# EAGLE design SenseBox-Eye_v1.4 (EAGLE 9.6.2)
Assembly variants: komplett, ohne fuel-gauge

## Sheet 1 of 5
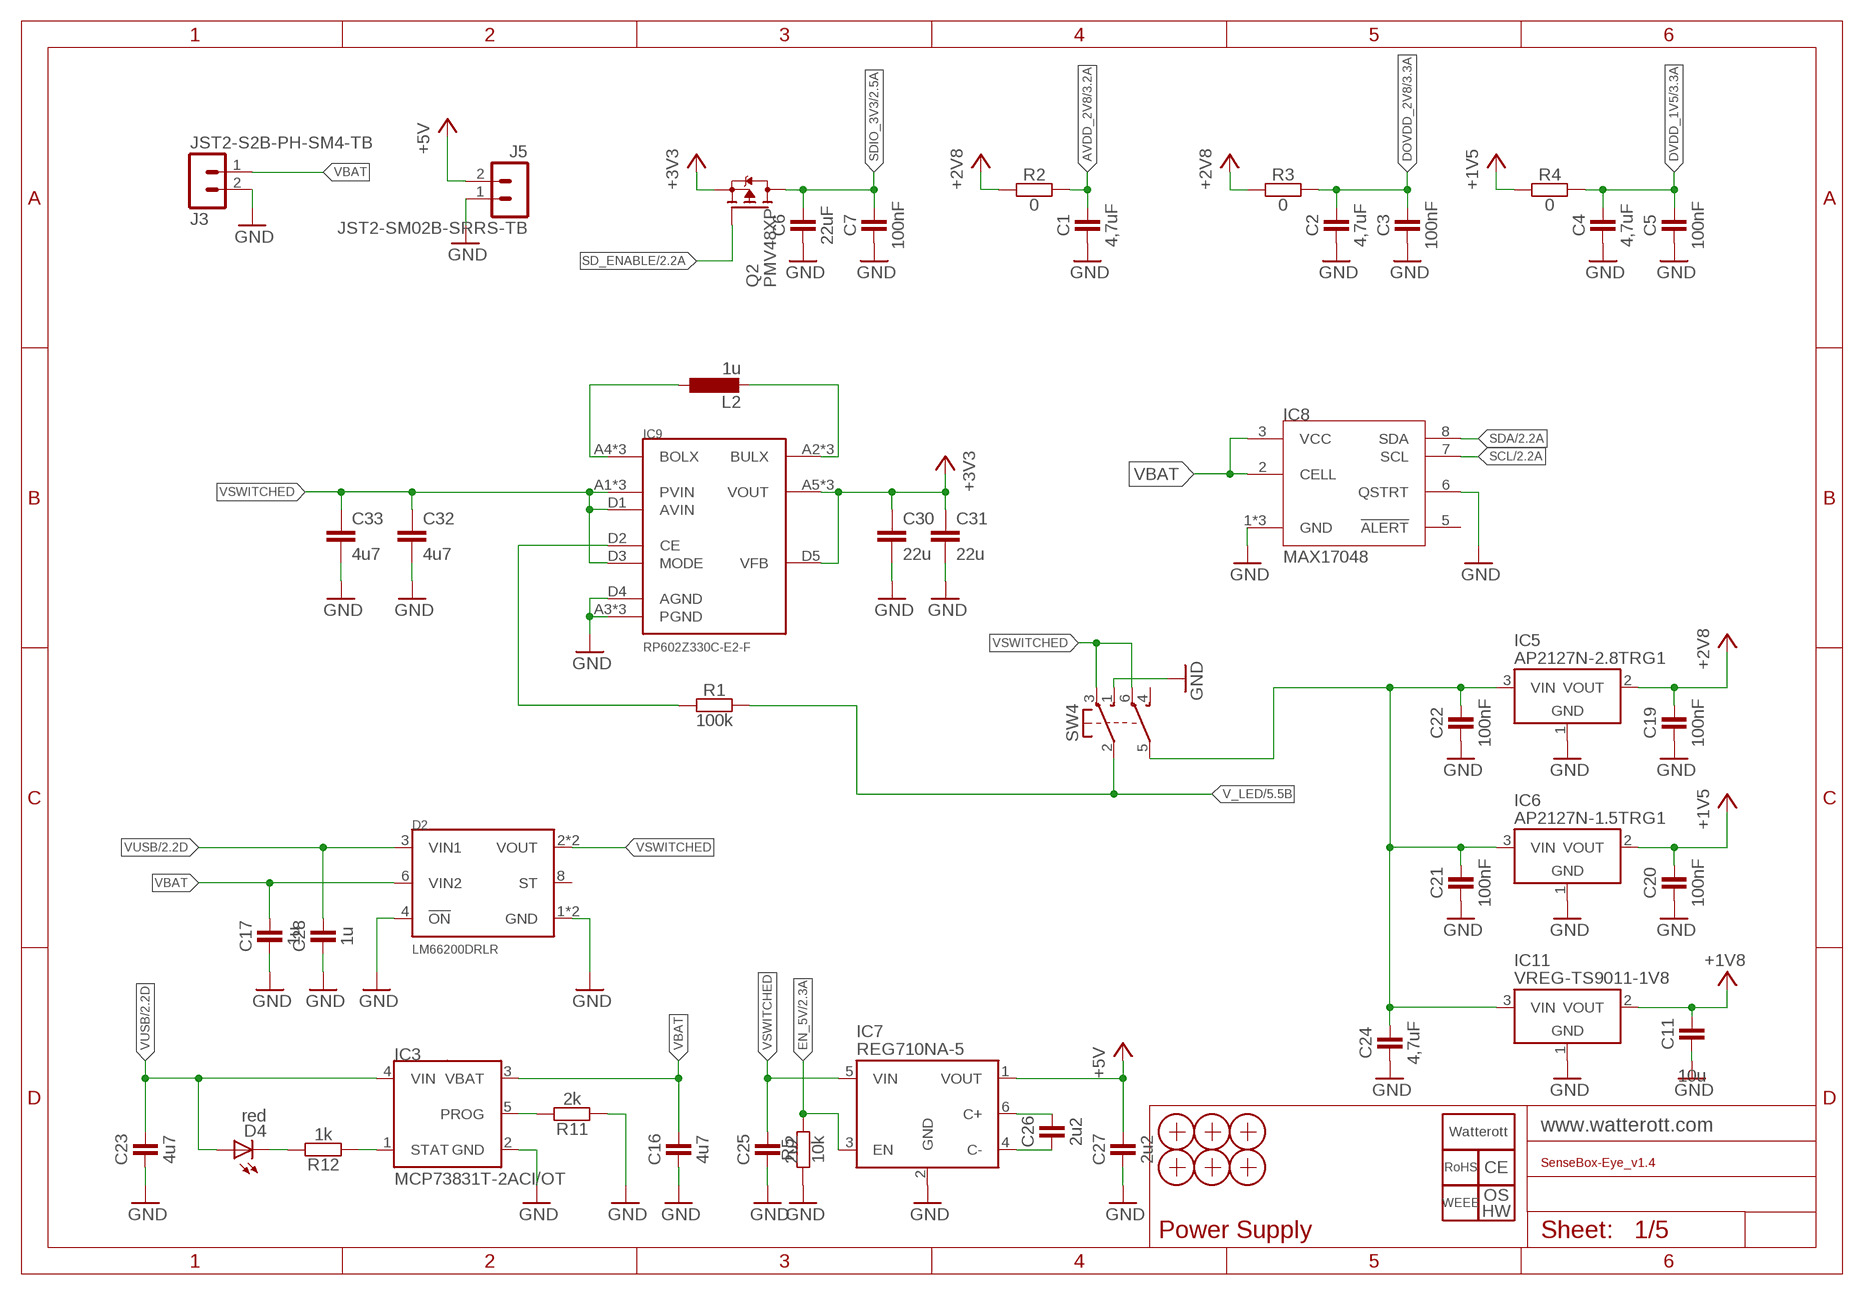
[diagram p0: schematic, sheet 1]

### Parts
C1  4,7uF  CAPACITOR-0402  [C0402]
C2  4,7uF  CAPACITOR-0402  [C0402]
C3  100nF  CAPACITOR-0402  [C0402]
C4  4,7uF  CAPACITOR-0402  [C0402]
C5  100nF  CAPACITOR-0402  [C0402]
C6  22uF  CAPACITOR-0402  [C0402]
C7  100nF  CAPACITOR-0402  [C0402]
C11  10u  CAPACITOR-0402  [C0402]
C16  4u7  CAPACITOR-0402  [C0402]
C17  1u  CAPACITOR-0402  [C0402]
C19  100nF  CAPACITOR-0402  [C0402]
C20  100nF  CAPACITOR-0402  [C0402]
C21  100nF  CAPACITOR-0402  [C0402]
C22  100nF  CAPACITOR-0402  [C0402]
C23  4u7  CAPACITOR-0402  [C0402]
C24  4,7uF  CAPACITOR-0402  [C0402]
C25  2u2  CAPACITOR-0402  [C0402]
C26  2u2  CAPACITOR-0402  [C0402]
C27  2u2  CAPACITOR-0402  [C0402]
C28  1u  CAPACITOR-0402  [C0402]
C30  22u  C_22U_0805N  [0805N]
C31  22u  C_22U_0805N  [0805N]
C32  4u7  C_4U7_0603N  [0603N]
C33  4u7  C_4U7_0603N  [0603N]
D2  LM66200DRLR  LM66200  [SOT-5X3]
D4  red  LED_RED_0603N  [0603N]
IC3  MCP73831T-2ACI/OT  MCP73831_MCP73831T-2ACI/OT_SOT23-5  [SOT23-5]
IC5  AP2127N-2.8TRG1  VREG-TS9011-3V3  [SOT23]
IC6  AP2127N-1.5TRG1  VREG-TS9011-3V3  [SOT23]
IC7  REG710NA-5  [SOT23-6]
IC8  MAX17048  MAX1704X  [UDFN8_2020]  (not fitted in variant ohne fuel-gauge)
IC9  RP602Z330C-E2-F  RP602_RP602Z330C-E2-F_WLCSP-20-P1  [WLCSP-20-P1]
IC11  VREG-TS9011-1V8  [SOT23]
J3  JST2-S2B-PH-SM4-TB  [JST_S2B-PH-SM4-TB]
J5  JST2-SM02B-SRRS-TB  [JST_SM02B-SRSS-TB]
L2  1u  L_WE-LQS-1U_5040  [5040]
LOGO2  LOGO_CE-5  [CE_5MM]
LOGO3  LOGO_OSHW-2  [OSHW_2MM]
LOGO4  LOGO_ROHS-2  [ROHS_2MM]
LOGO5  LOGO_WEEE-4  [WEEE_4MM]
LOGO6  LOGO_SPARK-2  [SPARK_2MM]
Q2  PMV48XP  MOSFET-P_PMV48XP_SOT23'  [SOT23]
R1  100k  RESISTOR-0402  [C0402]
R2  0  RESISTOR-0402  [C0402]
R3  0  RESISTOR-0402  [C0402]
R4  0  RESISTOR-0402  [C0402]
R5  10k  RESISTOR-0402  [C0402]
R11  2k  RESISTOR-0402  [C0402]
R12  1k  RESISTOR-0402  [C0402]
SW4  SW-2UM-CUS22B  [CUS22B]
X1  PASSER-04  [PASSER_04MM]
X2  PASSER-04  [PASSER_04MM]
X3  PASSER-04  [PASSER_04MM]
X4  PASSER-04  [PASSER_04MM]
X5  PASSER-04  [PASSER_04MM]
X6  PASSER-04  [PASSER_04MM]

### Nets
+1V5: C20.2 IC6.2(VOUT) R4.1
+1V8: C11.2 IC11.2(VOUT) ; also sheet 4
+2V8: C19.2 IC5.2(VOUT) R2.1 R3.1
+3V3: C30.1 C31.1 IC9.A5(VOUT) IC9.B5(VOUT) IC9.C5(VOUT) IC9.D5(VFB) Q2.2(S) ; also sheet 2,4,5
+5V: C27.2 IC7.1(VOUT) J5.2
AVDD_2V8: C1.2 R2.2 ; also sheet 3
BOLX: IC9.A4(BOLX) IC9.B4(BOLX) IC9.C4(BOLX) L2.1
BULX: IC9.A2(BULX) IC9.B2(BULX) IC9.C2(BULX) L2.2
DOVDD_2V8: C2.2 C3.2 R3.2 ; also sheet 3
DVDD_1V5: C4.2 C5.2 R4.2 ; also sheet 3
EN_5V: IC7.3(EN) R5.2 ; also sheet 2
ENABLE_3V3: IC9.D2(CE) R1.1
GND: C1.1 C2.1 C3.1 C4.1 C5.1 C6.1 C7.1 C11.1 C16.1 C17.1 C19.1 C20.1 C21.1 C22.1 C23.1 C24.1 C25.1 C27.1 C28.1 C30.2 C31.2 C32.2 C33.2 D2.1(GND) D2.4(!ON) D2.5(GND) IC3.2(GND) IC5.1(GND) IC6.1(GND) IC7.2(GND) IC8.1(GND) IC8.4(GND) IC8.6(QSTRT) IC8.TP(GND) IC9.A3(PGND) IC9.B3(PGND) IC9.C3(PGND) IC9.D4(AGND) IC11.1(GND) J3.2 J5.1 R5.1 R11.1 SW4.1(NO1) ; also sheet 2,3,4,5
N$5: C26.2 IC7.6(C+)
N$6: C26.1 IC7.4(C-)
N$8: D4.C R12.2
N$9: IC3.1(STAT) R12.1
N$10: IC3.5(PROG) R11.2
SCL: IC8.7(SCL) ; also sheet 2,4,5
SD_ENABLE: Q2.1(G) ; also sheet 2
SDA: IC8.8(SDA) ; also sheet 2,4,5
SDIO_3V3: C6.2 C7.2 Q2.3(D) ; also sheet 2
V_LED: R1.2 SW4.2(C1) ; also sheet 5
VBAT: C16.2 C17.2 D2.6(VIN2) IC3.3(VBAT) IC8.2(CELL) IC8.3(VCC) J3.1
VIN: C21.2 C22.2 C24.2 IC5.3(VIN) IC6.3(VIN) IC11.3(VIN) SW4.5(C2)
VSWITCHED: C25.2 C32.1 C33.1 D2.2(VOUT) D2.7(VOUT) IC7.5(VIN) IC9.A1(PVIN) IC9.B1(PVIN) IC9.C1(PVIN) IC9.D1(AVIN) IC9.D3(MODE) SW4.3(NC1) SW4.6(NC2)
VUSB: C23.2 C28.2 D2.3(VIN1) D4.A IC3.4(VIN) ; also sheet 2
Unconnected: D2.8(ST) IC8.5(!ALERT) SW4.4(NO2)

### Notes on the sheet
- Power Supply

## Sheet 2 of 5
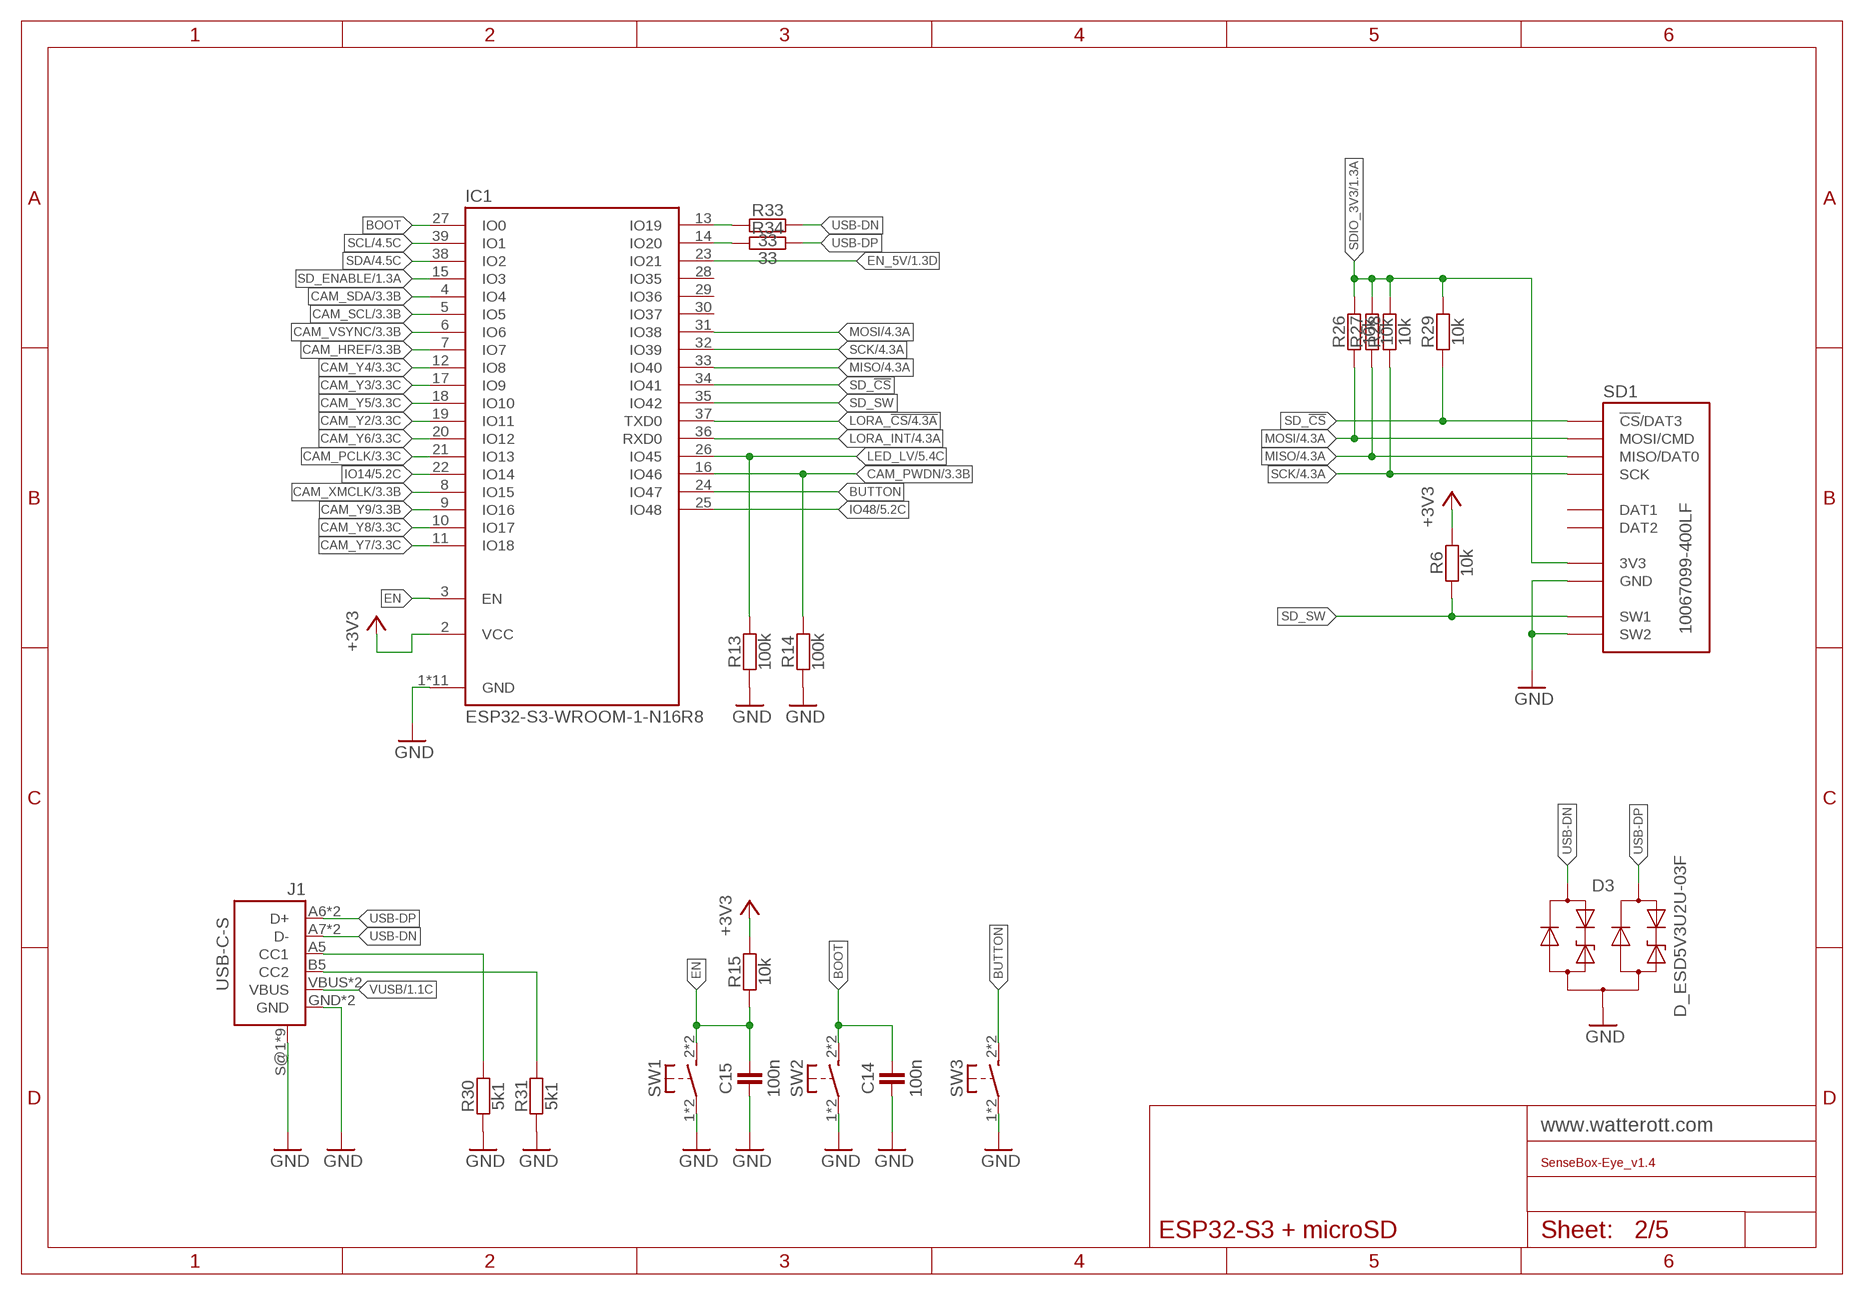
[diagram p1: schematic, sheet 2]

### Parts
C14  100n  CAPACITOR-0402  [C0402]
C15  100n  CAPACITOR-0402  [C0402]
D3  D_ESD5V3U2U-03F  [SOT723]
IC1  ESP32-S3-WROOM-1-N16R8  ESP32_S3-WROOM-1  [ESP32-S3-WROOM-1]
J1  USB-C-S  [USB-C-S]
R6  10k  RESISTOR-0402  [C0402]  (not fitted in variant ohne fuel-gauge)
R13  100k  RESISTOR-0402  [C0402]
R14  100k  RESISTOR-0402  [C0402]
R15  10k  RESISTOR-0402  [C0402]
R26  10k  RESISTOR-0402  [C0402]
R27  10k  RESISTOR-0402  [C0402]
R28  10k  RESISTOR-0402  [C0402]
R29  10k  RESISTOR-0402  [C0402]
R30  5k1  RESISTOR-0402  [C0402]
R31  5k1  RESISTOR-0402  [C0402]
R33  33  RESISTOR-0402  [C0402]
R34  33  RESISTOR-0402  [C0402]
SD1  10067099-400LF  SD-CARD-MSD47  [SD_47309XXXX]
SW1  SW-TACTILE-TL3305  [TL3305]
SW2  SW-TACTILE-TL3305  [TL3305]
SW3  SW-TACTILE-TL3305  [TL3305]

### Nets
+3V3: IC1.2(VCC) R6.2 R15.2 ; also sheet 1,4,5
BOOT: C14.2 IC1.27(IO0) SW2.2(S1) SW2.3(S1)
BUTTON: IC1.24(IO47) SW3.2(S1) SW3.3(S1)
CAM_HREF: IC1.7(IO7) ; also sheet 3
CAM_PCLK: IC1.21(IO13) ; also sheet 3
CAM_PWDN: IC1.16(IO46) R14.2 ; also sheet 3
CAM_SCL: IC1.5(IO5) ; also sheet 3
CAM_SDA: IC1.4(IO4) ; also sheet 3
CAM_VSYNC: IC1.6(IO6) ; also sheet 3
CAM_XMCLK: IC1.8(IO15) ; also sheet 3
CAM_Y2: IC1.19(IO11) ; also sheet 3
CAM_Y3: IC1.17(IO9) ; also sheet 3
CAM_Y4: IC1.12(IO8) ; also sheet 3
CAM_Y5: IC1.18(IO10) ; also sheet 3
CAM_Y6: IC1.20(IO12) ; also sheet 3
CAM_Y7: IC1.11(IO18) ; also sheet 3
CAM_Y8: IC1.10(IO17) ; also sheet 3
CAM_Y9: IC1.9(IO16) ; also sheet 3
CC1: J1.A5(CC1) R30.2
CC2: J1.B5(CC2) R31.2
EN: C15.2 IC1.3(EN) R15.1 SW1.2(S1) SW1.3(S1)
EN_5V: IC1.23(IO21) ; also sheet 1
GND: C14.1 C15.1 D3.3(A) IC1.1(GND) IC1.40(GND) IC1.P$1(GND) IC1.P$2(GND) IC1.P$3(GND) IC1.P$4(GND) IC1.P$5(GND) IC1.P$6(GND) IC1.P$7(GND) IC1.P$8(GND) IC1.P$9(GND) J1.GND J1.GND2(GND) J1.S@1(SHIELD) J1.S@2(SHIELD) J1.S@3(SHIELD) J1.S@4(SHIELD) J1.S@5(SHIELD) J1.S@6(SHIELD) J1.S@7(SHIELD) J1.S@8(SHIELD) J1.S@9(SHIELD) R13.1 R14.1 R30.1 R31.1 SD1.GND SD1.GND@1(GND) SD1.GND@2(GND) SD1.SW2 SW1.1 SW1.4(P1) SW2.1 SW2.4(P1) SW3.1 SW3.4(P1) ; also sheet 1,3,4,5
IO14: IC1.22(IO14) ; also sheet 5
IO19: IC1.13(IO19) R33.1
IO20: IC1.14(IO20) R34.1
IO48: IC1.25(IO48) ; also sheet 5
LED_LV: IC1.26(IO45) R13.2 ; also sheet 5
LORA_!CS: IC1.37(TXD0) ; also sheet 4
LORA_INT: IC1.36(RXD0) ; also sheet 4
MISO: IC1.33(IO40) R27.1 SD1.MISO(MISO/DAT0) ; also sheet 4
MOSI: IC1.31(IO38) R26.1 SD1.MOSI(MOSI/CMD) ; also sheet 4
SCK: IC1.32(IO39) R28.1 SD1.SCK ; also sheet 4
SCL: IC1.39(IO1) ; also sheet 1,4,5
SD_!CS: IC1.34(IO41) R29.1 SD1.CS(!CS!/DAT3)
SD_ENABLE: IC1.15(IO3) ; also sheet 1
SD_SW: IC1.35(IO42) R6.1 SD1.SW1
SDA: IC1.38(IO2) ; also sheet 1,4,5
SDIO_3V3: R26.2 R27.2 R28.2 R29.2 SD1.VCC(3V3) ; also sheet 1
USB-DN: D3.1(C1) J1.A7(D-) J1.B7(D-) R33.2
USB-DP: D3.2(C2) J1.A6(D+) J1.B6(D+) R34.2
VUSB: J1.VBUS J1.VBUS2(VBUS) ; also sheet 1
Unconnected: IC1.28(IO35) IC1.29(IO36) IC1.30(IO37) SD1.DAT1 SD1.DAT2

### Notes on the sheet
- ESP32-S3 + microSD

## Sheet 3 of 5
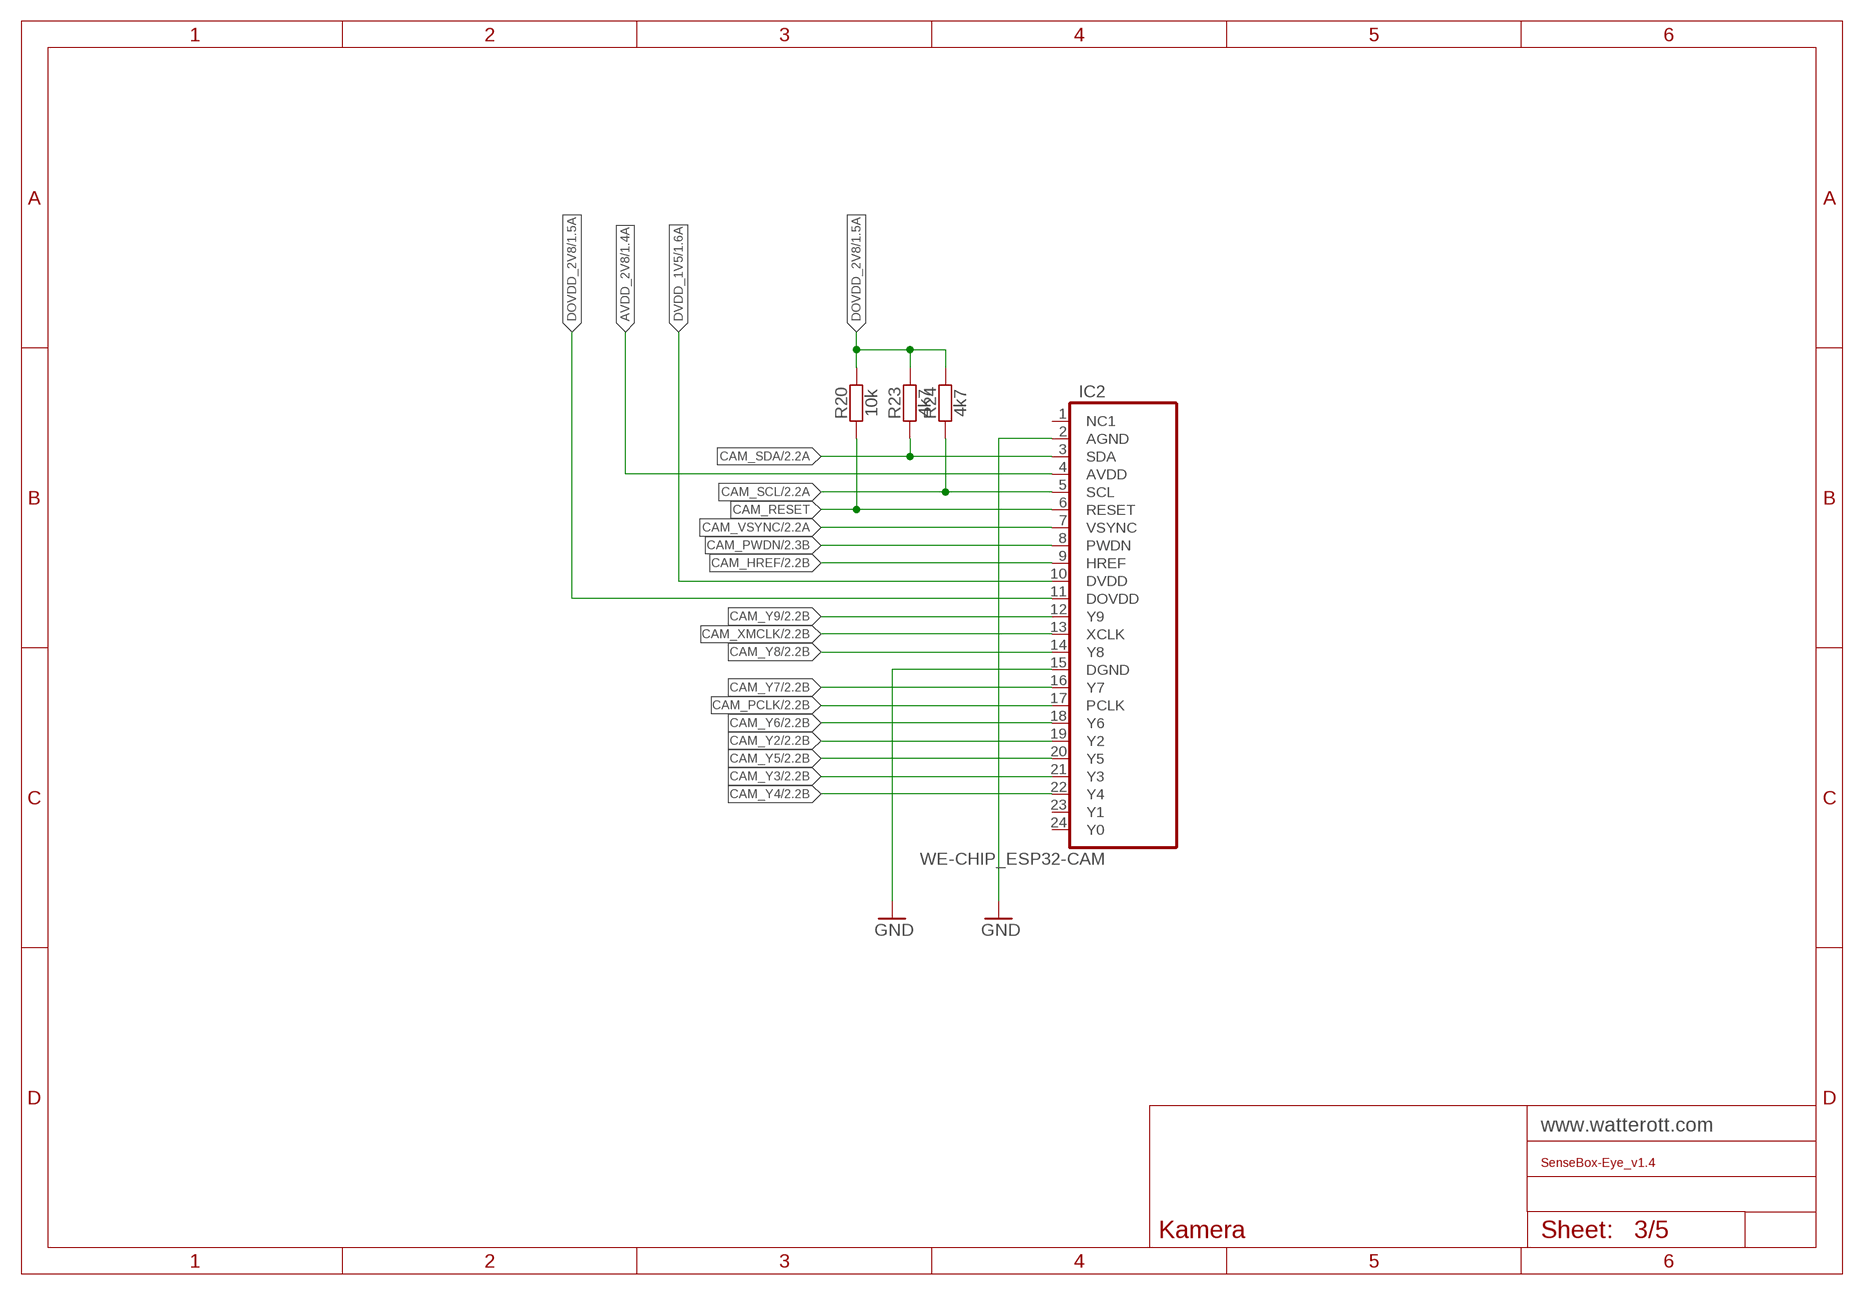
[diagram p2: schematic, sheet 3]

### Parts
IC2  WE-CHIP_ESP32-CAM  [WE-CHIP_FPC24-0.5-CAM]
R20  10k  RESISTOR-0402  [C0402]
R23  4k7  RESISTOR-0402  [C0402]
R24  4k7  RESISTOR-0402  [C0402]

### Nets
AVDD_2V8: IC2.4(AVDD) ; also sheet 1
CAM_HREF: IC2.9(HREF) ; also sheet 2
CAM_PCLK: IC2.17(PCLK) ; also sheet 2
CAM_PWDN: IC2.8(PWDN) ; also sheet 2
CAM_RESET: IC2.6(RESET) R20.1
CAM_SCL: IC2.5(SCL) R24.1 ; also sheet 2
CAM_SDA: IC2.3(SDA) R23.1 ; also sheet 2
CAM_VSYNC: IC2.7(VSYNC) ; also sheet 2
CAM_XMCLK: IC2.13(XCLK) ; also sheet 2
CAM_Y2: IC2.19(Y2) ; also sheet 2
CAM_Y3: IC2.21(Y3) ; also sheet 2
CAM_Y4: IC2.22(Y4) ; also sheet 2
CAM_Y5: IC2.20(Y5) ; also sheet 2
CAM_Y6: IC2.18(Y6) ; also sheet 2
CAM_Y7: IC2.16(Y7) ; also sheet 2
CAM_Y8: IC2.14(Y8) ; also sheet 2
CAM_Y9: IC2.12(Y9) ; also sheet 2
DOVDD_2V8: IC2.11(DOVDD) R20.2 R23.2 R24.2 ; also sheet 1
DVDD_1V5: IC2.10(DVDD) ; also sheet 1
GND: IC2.2(AGND) IC2.15(DGND) ; also sheet 1,2,4,5
Unconnected: IC2.1(NC1) IC2.23(Y1) IC2.24(Y0)

### Notes on the sheet
- Kamera

## Sheet 4 of 5
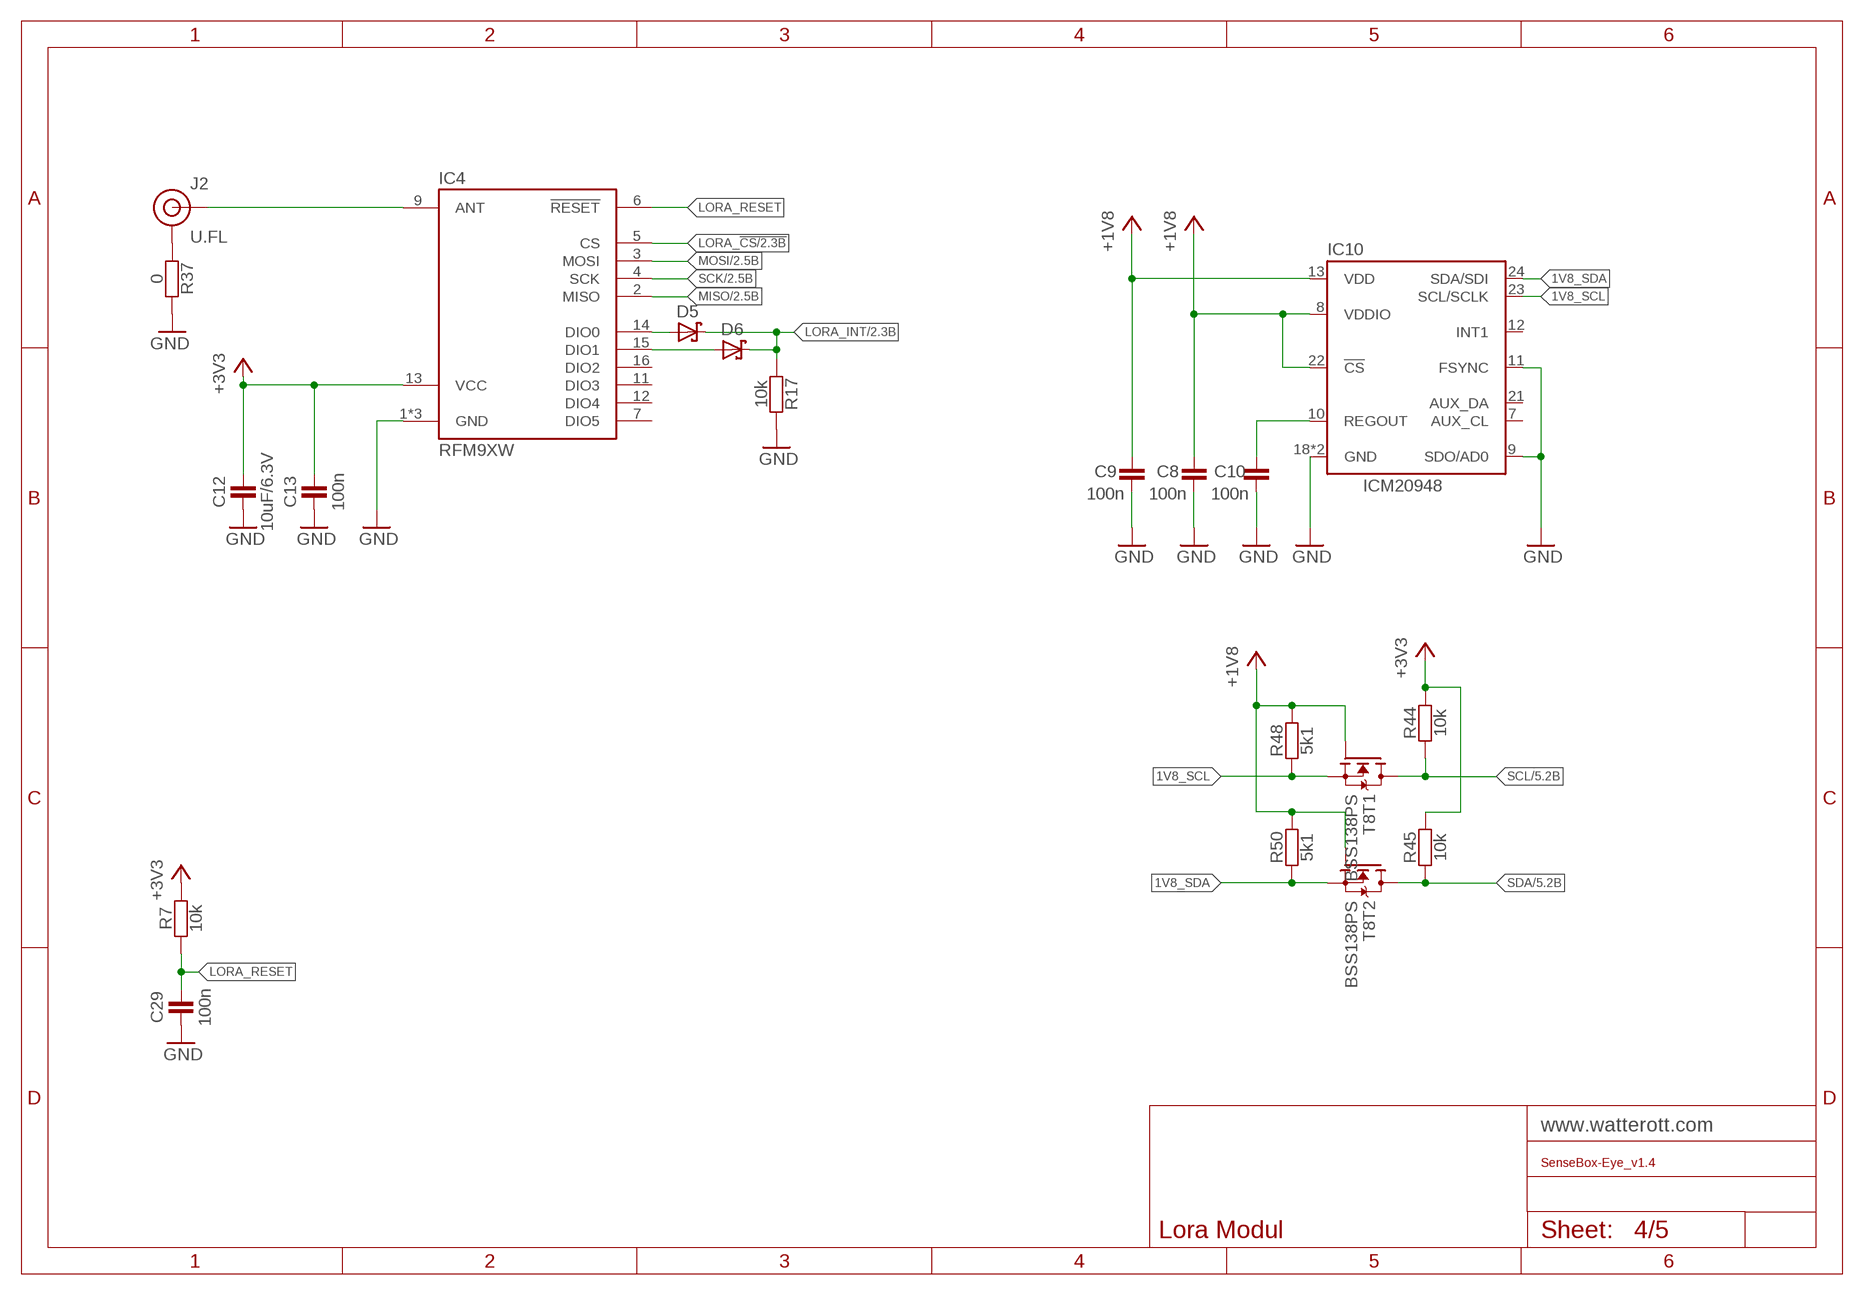
[diagram p3: schematic, sheet 4]

### Parts
C8  100n  CAPACITOR-0402  [C0402]
C9  100n  CAPACITOR-0402  [C0402]
C10  100n  CAPACITOR-0402  [C0402]
C12  10uF/6.3V  CAPACITOR-0402  [C0402]
C13  100n  CAPACITOR-0402  [C0402]
C29  100n  CAPACITOR-0402  [C0402]
D5  D_SCHOTTKY-SOD523  [SOD523]
D6  D_SCHOTTKY-SOD523  [SOD523]
IC4  RFM9XW  [RFM9X]
IC10  ICM20948  [QFN24-3X3]
J2  U.FL  [U.FL]
R7  10k  RESISTOR-0402  [C0402]
R17  10k  RESISTOR-0402  [C0402]
R37  0  RESISTOR-0402  [C0402]
R44  10k  RESISTOR-0402  [C0402]
R45  10k  RESISTOR-0402  [C0402]
R48  5k1  RESISTOR-0402  [C0402]
R50  5k1  RESISTOR-0402  [C0402]
T8  BSS138PS  [SOT363]

### Nets
1V8_SCL: IC10.23(SCL/SCLK) R48.1 T8.1(T1:S)
1V8_SDA: IC10.24(SDA/SDI) R50.1 T8.4(T2:S)
+1V8: C8.2 C9.2 IC10.8(VDDIO) IC10.13(VDD) IC10.22(!CS) R48.2 R50.2 T8.2(T1:G) T8.5(T2:G) ; also sheet 1
+3V3: C12.2 C13.2 IC4.13(VCC) R7.2 R44.2 R45.2 ; also sheet 1,2,5
ANT: IC4.9(ANT) J2.FEED(SIGNAL)
GND: C8.1 C9.1 C10.1 C12.1 C13.1 C29.1 IC4.1(GND) IC4.8(GND) IC4.10(GND) IC10.9(SDO/AD0) IC10.11(FSYNC) IC10.18(GND) IC10.20(GND) R17.1 R37.1 ; also sheet 1,2,3,5
LORA_!CS: IC4.5(CS) ; also sheet 2
LORA_INT: D5.C D6.C R17.2 ; also sheet 2
LORA_RESET: C29.2 IC4.6(!RESET) R7.1
MISO: IC4.2(MISO) ; also sheet 2
MOSI: IC4.3(MOSI) ; also sheet 2
N$1: D5.A IC4.14(DIO0)
N$2: D6.A IC4.15(DIO1)
N$3: J2.1(GND) J2.2(GND) R37.2
REGOUT1: C10.2 IC10.10(REGOUT)
SCK: IC4.4(SCK) ; also sheet 2
SCL: R44.1 T8.6(T1:D) ; also sheet 1,2,5
SDA: R45.1 T8.3(T2:D) ; also sheet 1,2,5
Unconnected: IC4.7(DIO5) IC4.11(DIO3) IC4.12(DIO4) IC4.16(DIO2) IC10.7(AUX_CL) IC10.12(INT1) IC10.21(AUX_DA)

### Notes on the sheet
- Lora Modul

## Sheet 5 of 5
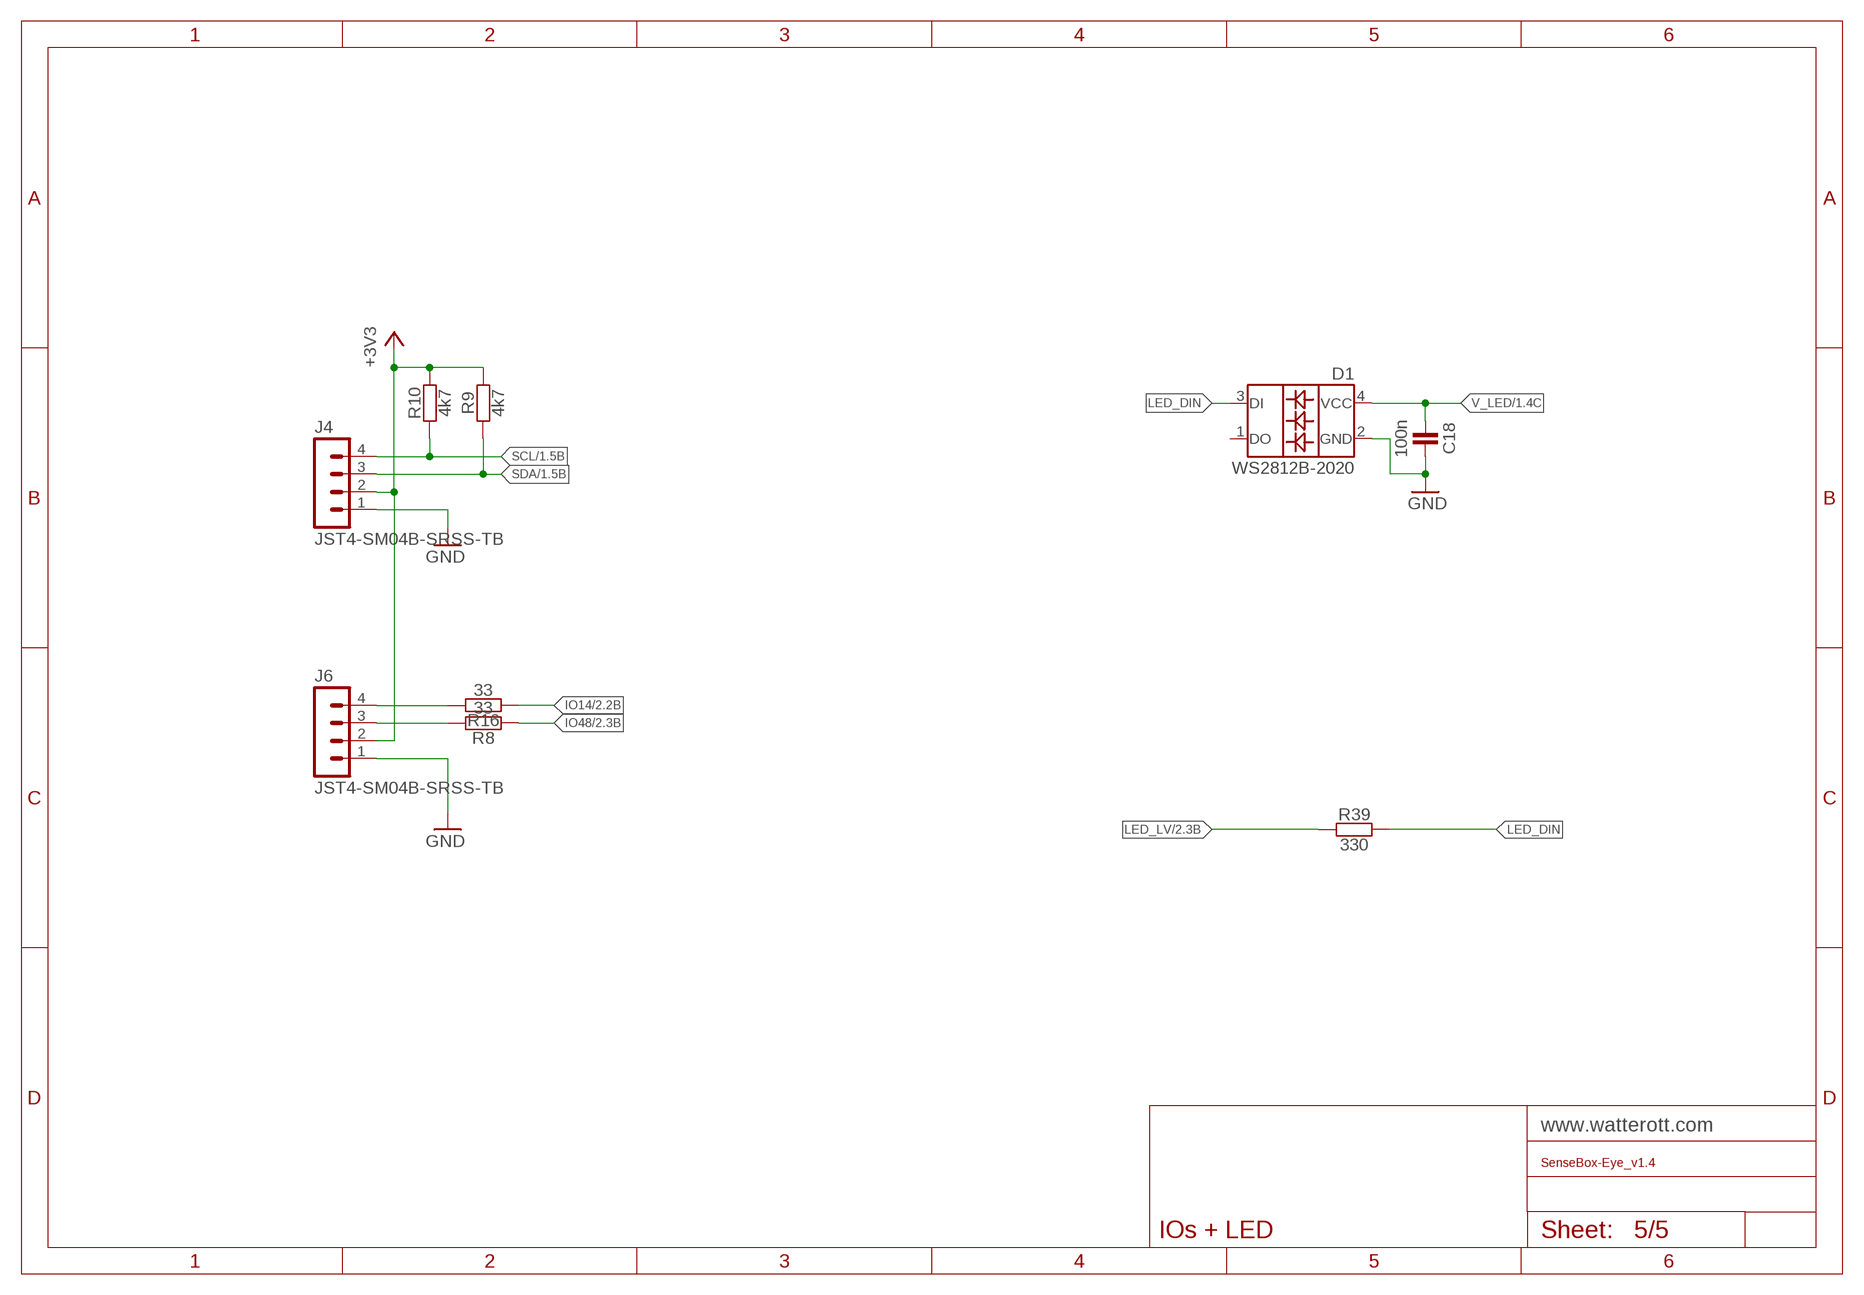
[diagram p4: schematic, sheet 5]

### Parts
C18  100n  CAPACITOR-0402  [C0402]
D1  WS2812B-2020  [WS2812_2020]
J4  JST4-SM04B-SRSS-TB  [JST_SM04B-SRSS-TB]
J6  JST4-SM04B-SRSS-TB  [JST_SM04B-SRSS-TB]
R8  33  RESISTOR-0402  [C0402]
R9  4k7  RESISTOR-0402  [C0402]
R10  4k7  RESISTOR-0402  [C0402]
R16  33  RESISTOR-0402  [C0402]
R39  330  RESISTOR-0402  [C0402]

### Nets
+3V3: J4.2 J6.2 R9.1 R10.1 ; also sheet 1,2,4
GND: C18.1 D1.2(GND) J4.1 J6.1 ; also sheet 1,2,3,4
IO14: R16.2 ; also sheet 2
IO48: R8.2 ; also sheet 2
LED_DIN: D1.3(DI) R39.2
LED_LV: R39.1 ; also sheet 2
N$4: J6.4 R16.1
N$13: J6.3 R8.1
SCL: J4.4 R10.2 ; also sheet 1,2,4
SDA: J4.3 R9.2 ; also sheet 1,2,4
V_LED: C18.2 D1.4(VCC) ; also sheet 1
Unconnected: D1.1(DO)

### Notes on the sheet
- IOs + LED

## Library data of the parts
C1-C29 = we-rcl:CAPACITOR: Capacitor ...2.2uF @ 6.3V -> 0402 ...4.7uF @ 6.3V -> 0603 ...10uF @ 16V -> 0805 ...22uF @ 25V -> 1206
C30 C31 = BE_capacitor:C: Capacitor; BE#: 208; DIELECTRIC: X5R; VOLTAGE: 6V3
C32 C33 = BE_capacitor:C: Capacitor; BE#: 284; DIELECTRIC: X5R; VOLTAGE: 6V3
D1 = we-opto:WS2812B: WS2812 RGB LED (built-in driver)
D2 = BE_diode:LM66200: LM66200 1.6-5V, 2.5A Dual Ideal Diode with Automatic Switchover; BE#: 2291
D3 = we-rcl:D_ESD5V3U2U: ESD5V3U2U TVS Diode (Uni-directional Ultra Low ESD) Vrwm=5.3V, 0.4pF@1MHz; DIGIKEY: ESD5V3U2U-03F H6327DKR-ND
D4 = BE_opto:LED: Single LED; BE#: 224
D5 D6 = we-rcl:D_SCHOTTKY: Schottky Diode 1A, 30V - SOD323 (BAS3010B) 3A, 100V - SOD123 (S310A)
IC1 = we-chip:ESP32_S3-WROOM-1: Espressif ESP32-S3-WROOM-1 ESP32 WiFi/WLAN + Bluetooth/BLE Module<
IC2 = SenseBox-Eye:WE-CHIP_ESP32-CAM: ESP32-CAM OV2640 Camera module
IC3 = BE_dcdc:MCP73831: Miniature Single-Cell, Fully Integrated Li-Ion, Li-Polymer Charge Management Controllers up to 500mA; BE#: 2283
IC4 = we-chip:RFM9X: HopeRF RFM9xW LoRa Module RFM95W 868/915 MHz (SX1276 compatible) RFM96W 433/470 MHz (SX1276 compatible)
IC5 IC6 IC11 = we-power:VREG: Voltage Regulator LDOs Taiwan Semi TS1117 800mA max 15V - compatible On Semi NCP1117 1A max 20V - compatible Diodes AP2111H 0.6A max 6V (0.25V@0.6A) - compatible Diodes AP2114H 1A max 6V (0.45V@1A) Taiwan Semi TS9011 250mA max 12V - compatible Diodes AP2210 300mA max 15V - compatible Microchip MCP1700 250mA max 6.5V - compatible Microchip MCP1702 250mA max 13V - compatible Microchip MCP1703 250mA max 16V - compatible Microchip MCP1754 150mA max 16V Taiwan Semi TS5204 80mA max 16V (low noise) DC/DC Converter Modules Recom R-78Ex.x-1.0-W36 1A max 28V - compatible CUI V78xx-2000 2A max 18V Murata OKI-78SR-x.x/1.5-W36 1.5A max 36V
IC7 = we-power:REG710NA: TI REG710xx Charge Pump with Regulated Output TI REG710xx (60mA) 5.5V - REG71055 5.0V - REG710NA-5 or REG71050 3.3V - REG710NA-3.3 3.0V - REG710NA-3 2.7V - REG710NA-2.7 2.5V - REG710NA-2.5 Diodes AP3602 (100mA) 5.0V - AP3602A 4.5V - AP3602B OnSemi CAT3200 (100mA) 5.0V - CAT3200TDI
IC8 = we-power:MAX1704X
IC9 = BE_dcdc:RP602: 1.5 A PWM/VFM Buck-Boost DC/DC Converter with Synchronous Rectifier; BE#: 2281
IC10 = we-sensor:ICM20948
J1 = we-con:USB-C: USB-C Connector Hroparts TYPE-C-31-M-12 or Jing C167321 or XKB U262-161N-4BVC11 Up: XKB U263-241N-4BQC11-1 or Wuerth 632722110112
J2 = we-con:U.FL: U.FL Connector
J3 J5 = we-con:JST2: JST Connector
J4 J6 = we-con:JST4: JST Connector
L2 = BE_inductor:L: Inductor; BE#: 2282; CURRENT: 4.9; INDUCTANCE: 1u
LOGO2 = we-symbol:LOGO_CE: CE Logo
LOGO3 = we-symbol:LOGO_OSHW: Open-Source-Hardware Logo
LOGO4 = we-symbol:LOGO_ROHS: RoHS Logo
LOGO5 = we-symbol:LOGO_WEEE: WEEE Logo
LOGO6 = we-symbol:LOGO_SPARK: Watterott electronic Logo
Q2 = BE_transistor:MOSFET-P: Single P-Channel Mosfet; BE#: 271; CURRENT: 3.5; VOLTAGE: 20
R1-R17 R20 R23 R24 R26-R31 R33 R34 R37 R39 R44 R45 R48 R50 = we-rcl:RESISTOR: Resistor all kinds in 0402 and 0603
SD1 = we-con:SD-CARD: SD-Card Socket
SW1-SW3 = we-switch:SW-TACTILE: Tactile Switche
SW4 = we-switch:SW-2UM: Switch; DIGIKEY: 563-1105-6-ND
T8 = we-transistor:BSS138PS: BSS138 Dual N-Chn MOSFET (Vgs>=+/-20V, Vds>=40V, Id>=0.2A + Rds<=3Ohm @ Vgs=4.5V) BSS138PS compatible: 2N7002PS, Si1926DL, BSS138BKS (with ESD protection)
X1-X6 = we-symbol:PASSER: Fiducial Marker

## Board
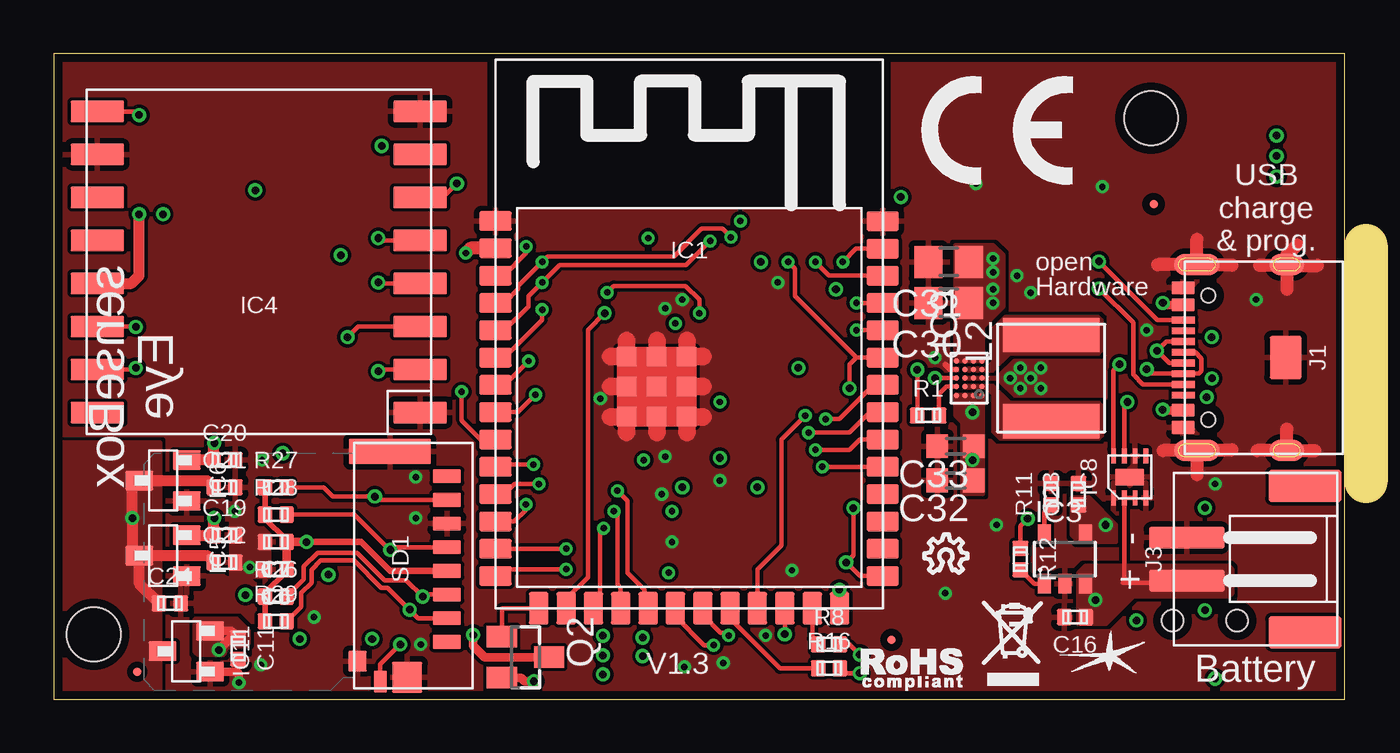
[diagram p5: board, top side]
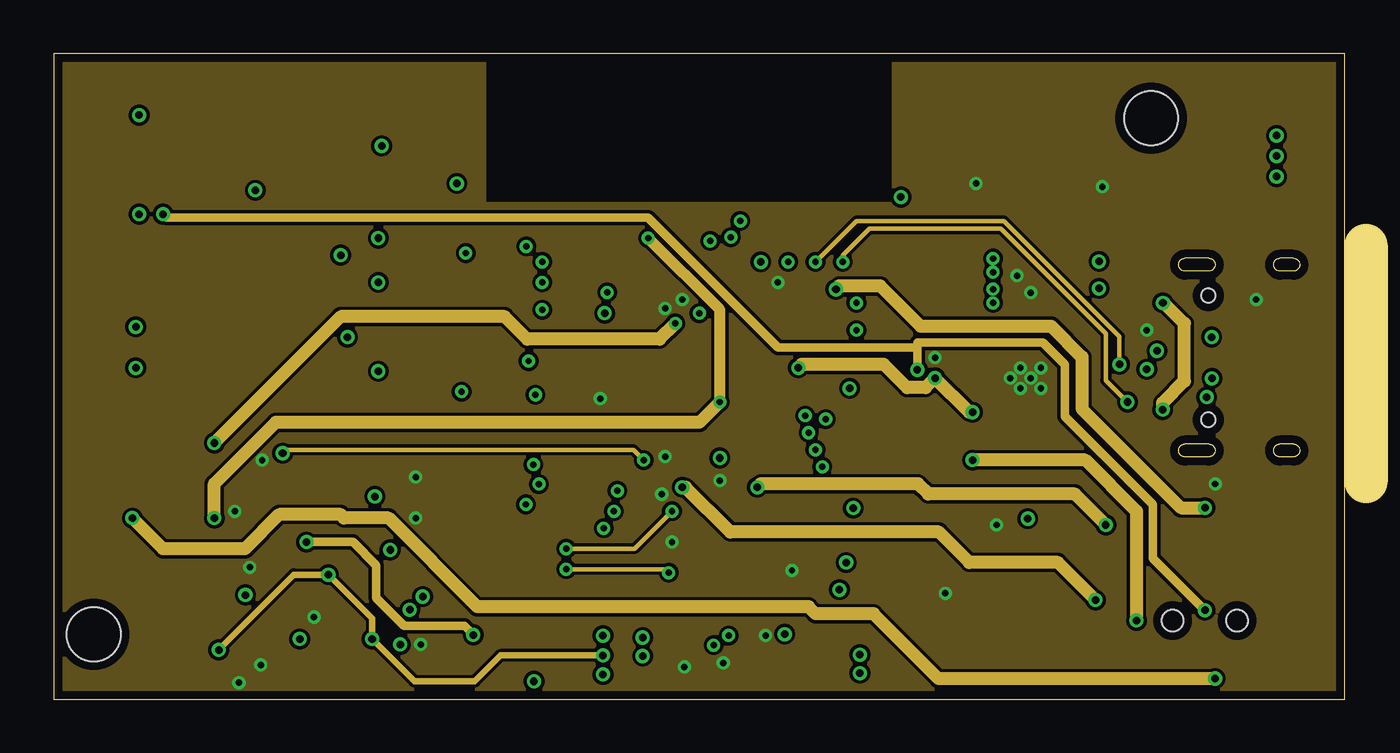
[diagram p6: board, inner layer Route2]
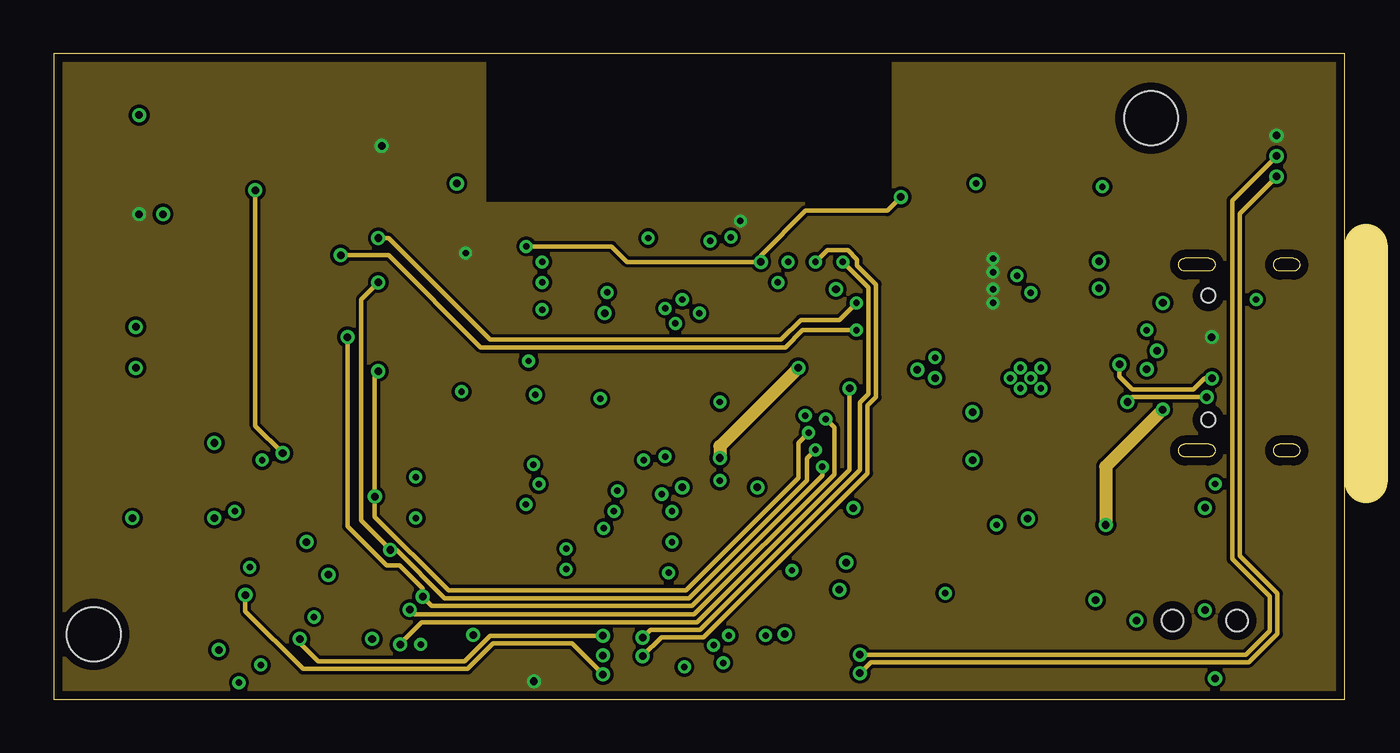
[diagram p7: board, inner layer Route15]
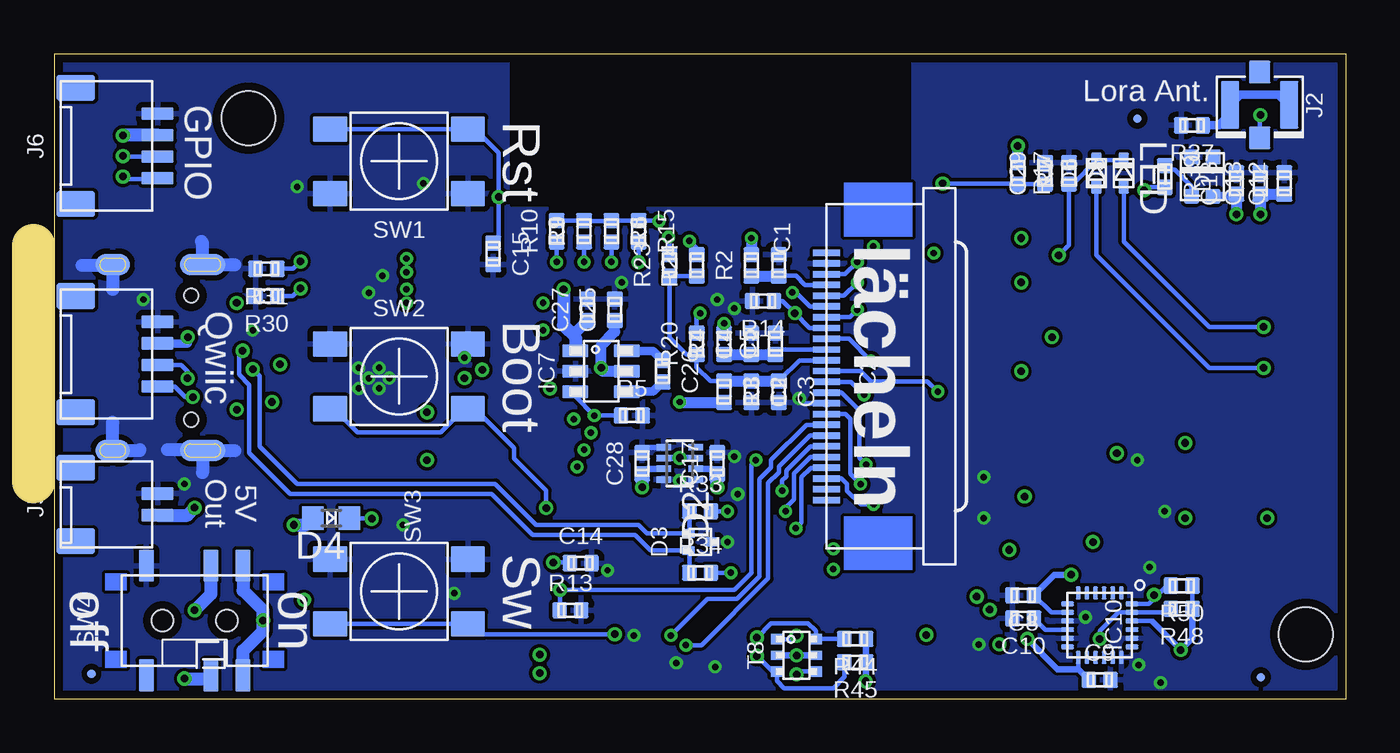
[diagram p8: board, bottom side, seen from below]

Size 60 x 30 mm. Coordinates in mm from the lower left corner, seen from the top.
Outline: 0,0 60,0 60,30 0,30 0,0
Copper layers (1+2*15+16): Top 0.035mm / dielectric 0.35mm / Route2 0.035mm / dielectric 0.76mm / Route15 0.035mm / dielectric 0.35mm / Bottom 0.035mm
Design rules "we-dru-4-layer": minimum track width 6mil, minimum drill 0.3mm, track to track 6mil, track to pad 6mil, pad to pad 8mil, via to via 8mil, smd to smd 4mil, copper to edge 0.4mm, drill to drill 0.4mm, minimum pad ring 6mil, minimum via ring 6mil, stop-mask expansion 0.1mm, vias tented up to drill 0.5mm, thermal gap 0.25mm
Holes 2.5 mm at 1.86,3 51,27
Milling: 1 lines

### Footprints (pad centres in the part's own frame; a part is rotated, then mirrored left to right if it is on the bottom)
C0402 = smd 0.75 x 0.7: 1 0,0.5; 2 0,-0.5
0805N = smd 1.3 x 1.5: 1 -0.95,0; 2 0.95,0
0603N = smd 1 x 1.1: 1 -0.85,0; 2 0.85,0
WS2812_2020 = smd 0.7 x 0.7: 1 -0.915,0.5; 2 -0.915,-0.5; 3 0.915,-0.5; 4 0.915,0.5
SOT-5X3 = smd 0.3 x 0.67: 1 -0.75,-0.74; 2 -0.25,-0.74; 3 0.25,-0.74; 4 0.75,-0.74; 5 0.75,0.74; 6 0.25,0.74; 7 -0.25,0.74; 8 -0.75,0.74
SOT723 = smd 0.6 x 0.4: 1 -0.55,0.4; 2 -0.55,-0.4; 3 0.55,0
0603N' = smd 1 x 1.1: A 0.85,0; C -0.85,0
SOD523 = smd 0.5 x 0.7: A 0,-0.6; C 0,0.6
ESP32-S3-WROOM-1 = smd 1.5 x 0.9: 1 -9,8.255; 2 -9,6.985; 3 -9,5.715; 4 -9,4.445; 5 -9,3.175; 6 -9,1.905; 7 -9,0.635; 8 -9,-0.635; 9 -9,-1.905; 10 -9,-3.175; 11 -9,-4.445; 12 -9,-5.715; 13 -9,-6.985; 14 -9,-8.255; 27 9,-8.255; 28 9,-6.985; 29 9,-5.715; 30 9,-4.445; 31 9,-3.175; 32 9,-1.905; 33 9,-0.635; 34 9,0.635; 35 9,1.905; 36 9,3.175; 37 9,4.445; 38 9,5.715; 39 9,6.97; 40 9,8.24 | smd 0.9 x 1.5: 15 -6.985,-9.745; 16 -5.715,-9.745; 17 -4.445,-9.745; 18 -3.175,-9.745; 19 -1.905,-9.745; 20 -0.635,-9.745; 21 0.635,-9.745; 22 1.905,-9.745; 23 3.175,-9.745; 24 4.445,-9.745; 25 5.73,-9.745; 26 7,-9.745 | smd 0.9 x 0.9: P$1 -1.5,0.555; P$2 -0.1,0.555; P$3 -0.1,-0.845; P$4 -1.5,-0.845; P$5 -2.9,-0.845; P$6 -2.9,0.555; P$7 -2.9,1.955; P$8 -1.5,1.955; P$9 -0.1,1.955
WE-CHIP_FPC24-0.5-CAM = smd 1.27 x 0.279: 1 0,5.75; 2 0,5.25; 3 0,4.75; 4 0,4.25; 5 0,3.75; 6 0,3.25; 7 0,2.75; 8 0,2.25; 9 0,1.75; 10 0,1.25; 11 0,0.75; 12 0,0.25; 13 0,-0.25; 14 0,-0.75; 15 0,-1.25; 16 0,-1.75; 17 0,-2.25; 18 0,-2.75; 19 0,-3.25; 20 0,-3.75; 21 0,-4.25; 22 0,-4.75; 23 0,-5.25; 24 0,-5.75
SOT23-5 = smd 0.6 x 0.9: 1 -0.95,-1.15; 2 0,-1.15; 3 0.95,-1.15; 4 0.95,1.15; 5 -0.95,1.15
RFM9X = smd 2.5 x 1: 1 -7.5,7; 2 -7.5,5; 3 -7.5,3; 4 -7.5,1; 5 -7.5,-1; 6 -7.5,-3; 7 -7.5,-5; 8 -7.5,-7; 9 7.5,-7; 10 7.5,-5; 11 7.5,-3; 12 7.5,-1; 13 7.5,1; 14 7.5,3; 15 7.5,5; 16 7.5,7
SOT23 = smd 1.3 x 0.9: 1 -1.1,0.95; 2 -1.1,-0.95; 3 1.1,0
SOT23-6 = smd 1.2 x 0.6: 1 -1.2,0.95; 2 -1.2,0; 3 -1.2,-0.95; 4 1.2,-0.95; 5 1.2,0; 6 1.2,0.95
UDFN8_2020 = smd 0.7 x 0.28: 1 -0.975,0.75; 2 -0.975,0.25; 3 -0.975,-0.25; 4 -0.975,-0.75; 5 0.975,-0.75; 6 0.975,-0.25; 7 0.975,0.25; 8 0.975,0.75 | smd 0.8 x 1.35: TP 0,0
WLCSP-20-P1 = smd 0.265 x 0.265: A1 -0.8,-0.6; A2 -0.4,-0.6; A3 0,-0.6; A4 0.4,-0.6; A5 0.8,-0.6; B1 -0.8,-0.2; B2 -0.4,-0.2; B3 0,-0.2; B4 0.4,-0.2; B5 0.8,-0.2; C1 -0.8,0.2; C2 -0.4,0.2; C3 0,0.2; C4 0.4,0.2; C5 0.8,0.2; D1 -0.8,0.6; D2 -0.4,0.6; D3 0,0.6; D4 0.4,0.6; D5 0.8,0.6
QFN24-3X3 = smd 0.6 x 0.22: 1 -1.5,1; 2 -1.5,0.6; 3 -1.5,0.2; 4 -1.5,-0.2; 5 -1.5,-0.6; 6 -1.5,-1; 13 1.5,-1; 14 1.5,-0.6; 15 1.5,-0.2; 16 1.5,0.2; 17 1.5,0.6; 18 1.5,1 | smd 0.22 x 0.6: 7 -1,-1.5; 8 -0.6,-1.5; 9 -0.2,-1.5; 10 0.2,-1.5; 11 0.6,-1.5; 12 1,-1.5; 19 1,1.5; 20 0.6,1.5; 21 0.2,1.5; 22 -0.2,1.5; 23 -0.6,1.5; 24 -1,1.5
USB-C-S = smd 1.1 x 0.3: A5 -1.155,-1.25; A6 -1.155,-0.25; A7 -1.155,0.25; A8 -1.155,1.25; B5 -1.155,1.75; B6 -1.155,0.75; B7 -1.155,-0.75; B8 -1.155,-1.75 | smd 1.05 x 0.6: GND -1.175,3.25; GND2 -1.175,-3.25; VBUS -1.175,2.45; VBUS2 -1.175,-2.45 | smd 2.1 x 1: S@1 -0.53,4.32; S@5 -0.53,-4.32 | smd 2.1 x 1 bottom: S@2 -0.53,4.32; S@6 -0.53,-4.32 | smd 1.6 x 1: S@3 3.65,4.32; S@7 3.65,-4.32 | smd 1.6 x 1 bottom: S@4 3.65,4.32; S@8 3.65,-4.32 | smd 1.5 x 2: S@9 3.6,0 | hole 0.65: 0,-2.89; 0,2.89
U.FL = smd 2.2 x 0.85: 1 0,1.375; 2 0,-1.375 | smd 1.05 x 1: FEED 1.525,0; NC -1.525,0
JST_S2B-PH-SM4-TB = smd 3.5 x 1: 1 1,1; 2 1,-1 | smd 3.4 x 1.5: SHLD1 -4.5,3.4; SHLD2 -4.5,-3.4
JST_SM04B-SRSS-TB = smd 1.5 x 0.6: 1 2.4,1.5; 2 2.4,0.5; 3 2.4,-0.5; 4 2.4,-1.5 | smd 1.8 x 1.2: SHLD1 -1.4,-2.7; SHLD2 -1.4,2.7
JST_SM02B-SRSS-TB = smd 1.5 x 0.6: 1 2.4,0.5; 2 2.4,-0.5 | smd 1.8 x 1.2: SHLD1 -1.4,-1.7; SHLD2 -1.4,1.7
5040 = smd 1.6 x 4.5: 1 -2,0; 2 2,0
SOT23' = smd 1 x 1.4: 1 -0.95,-1.1; 2 0.95,-1.1; 3 0,1.1
SD_47309XXXX = smd 0.65 x 1.3: CS 2.75,4.3; DAT1 -3.85,4.3; DAT2 3.85,4.3; GND -1.65,4.3; MISO -2.75,4.3; MOSI 1.65,4.3; SCK -0.55,4.3; VCC 0.55,4.3 | smd 1.2 x 3.8: GND@1 -5,1.65 | smd 1.45 x 1.4: GND@2 5.5,2.45 | smd 1 x 0.6: SW1 5.7,1.2 | smd 0.95 x 0.85: SW2 4.75,0.15
TL3305 = smd 1.6 x 1.2: 1 -3.2,1.5; 2 -3.2,-1.5; 3 3.2,-1.5; 4 3.2,1.5
CUS22B = smd 0.7 x 1.5: 1 -2.25,2.55; 2 0.75,2.55; 3 2.25,2.55; 4 -2.25,-2.55; 5 0.75,-2.55; 6 2.25,-2.55 | hole 1: -1.5,0; 1.5,0
SOT363 = smd 0.6 x 0.5: 1 -0.9,0.75; 3 -0.9,-0.75; 4 0.9,-0.75; 6 0.9,0.75 | smd 0.6 x 0.4: 2 -0.9,0; 5 0.9,0
PASSER_04MM = smd 0.4 x 0.4: X 0,0

### Placement (x,y rotation side)
C1  26.35,20.16 0 bottom
C2  27.62,14.29 180 bottom
C3  26.35,14.29 180 bottom
C4  27.62,16.51 0 bottom
C5  26.51,16.51 0 bottom
C6  10.32,6.03 90 top
C7  10.32,7.3 90 top
C8  14.99,4.83 90 bottom
C9  11.43,0.89 270 bottom
C10  14.99,3.75 90 bottom
C11  8.57,2.35 180 top
C12  2.86,23.97 0 bottom
C13  3.97,23.97 0 bottom
C14  35.56,6.32 270 bottom
C15  39.62,20.7 180 bottom
C16  47.47,3.81 90 top
C17  29.21,10.95 0 bottom
C18  5.08,23.97 0 bottom
C19  7.94,7.62 270 top
C20  7.94,11.11 270 top
C21  7.94,9.84 270 top
C22  7.94,6.35 270 top
C23  47.62,9.53 0 top
C24  5.4,4.45 270 top
C25  33.97,18.1 0 bottom
C26  31.75,15.24 180 bottom
C27  35.24,18.1 0 bottom
C28  32.7,10.95 0 bottom
C29  13.97,24.45 0 bottom
C30  41.59,18.41 180 top
C31  41.59,20.32 180 top
C32  41.91,10.16 180 top
C33  41.91,11.75 180 top
D1  6.67,24.29 270 bottom
D2  30.96,10.95 270 bottom
D3  30,7.3 0 bottom
D4  red  [0603N']  47.15,8.41 180 bottom
D5  10.32,24.45 0 bottom
D6  11.59,24.45 0 bottom
IC1  29.53,13.97 0 top
IC2  24.13,15 0 bottom
IC3  46.99,6.51 0 top
IC4  9.53,20.32 180 top
IC5  5.08,6.67 180 top
IC6  5.08,10.16 180 top
IC7  34.61,15.24 0 bottom
IC8  50.01,10.32 90 top
IC9  42.55,14.92 90 top
IC10  11.43,3.43 270 bottom
IC11  6.16,2.22 180 top
J1  53.66,15.88 0 top
J2  4,27.62 270 bottom
J3  53.66,6.51 180 top
J4  57.63,16.03 0 bottom
J5  57.63,9.05 0 bottom
J6  57.63,25.72 0 bottom
L2  46.35,14.92 270 top
LOGO2  42.84,26.44 0 top
LOGO3  41.47,6.76 0 top
LOGO4  39.89,1.38 0 top
LOGO5  44.53,2.6 0 top
LOGO6  49.06,1.99 180 top
Q2  PMV48XP  [SOT23']  21.93,1.94 270 top
R1  40.64,13.18 270 top
R2  27.62,20.16 0 bottom
R3  28.89,14.29 180 bottom
R4  28.89,16.51 0 bottom
R5  33.18,13.18 270 bottom
R6  34.13,21.75 180 bottom
R7  15.24,24.45 180 bottom
R8  36.04,2.54 270 top
R9  35.4,21.75 0 bottom
R10  36.67,21.75 0 bottom
R11  46.35,9.53 0 top
R12  44.93,6.51 180 top
R13  36.04,4.13 270 bottom
R14  27.08,18.51 90 bottom
R15  32.86,21.75 180 bottom
R16  36.04,1.43 270 top
R17  12.86,24.45 0 bottom
R20  30.16,16.51 0 bottom
R23  31.43,20.16 0 bottom
R24  30.16,20.16 0 bottom
R26  10.32,4.76 270 top
R27  10.32,9.84 270 top
R28  10.32,8.57 270 top
R29  10.32,3.62 270 top
R30  50.16,18.73 90 bottom
R31  50.16,20 90 bottom
R33  30,8.73 270 bottom
R34  30,5.87 270 bottom
R37  7.14,26.67 90 bottom
R39  8.41,24.29 180 bottom
R44  22.8,2.79 90 bottom
R45  22.8,1.71 90 bottom
R48  7.62,4.19 90 bottom
R50  7.62,5.27 90 bottom
SD1  13.97,6.51 270 top
SW1  44,25 180 bottom
SW2  44,15 0 bottom
SW3  44,5 0 bottom
SW4  53.5,3.65 0 bottom
T8  25.53,2.03 0 bottom
X1  38.93,2.75 0 top
X2  3.88,1.26 0 top
X3  51.12,23.02 0 top
X4  58.3,1.17 0 bottom
X5  9.68,26.99 0 bottom
X6  3.94,1.01 0 bottom

### Tracks (layer width: path | path; a pad name or v marks a point on that pad's centre or on a via)
1V8_SCL  (via drill 0.35)
  Route15 0.2: v11.43,2.79 11.43,2.6 12.28,1.76 19.09,1.76 20.28,2.94 v25.53,2.94
  Bottom 0.2: T8.1 25.69,2.78 v25.53,2.94 | R48.1 8.28,4.03 IC10.23 10.58,4.03 11.43,3.17 v11.43,2.79
1V8_SDA  (via drill 0.35)
  Route15 0.2: v8.9,4.84 8.9,4.08 11.58,1.41 19.24,1.41 20.43,2.59 24.08,2.59 v25.53,1.14
  Bottom 0.2: 8.82,4.76 9.15,4.43 IC10.24 | 8.82,4.76 8.31,5.27 R50.1 | 8.82,4.76 v8.9,4.84 | v25.53,1.14 25.39,1.28 T8.4
+1V5  (via drill 0.3, 0.35)
  Top 0.508: IC6.2 C20.2 7.44,11.88 v7.46,11.91
  Route2 0.61: v28.89,17.46 28.16,16.73 22,16.73 20.95,17.78 13.34,17.78 v7.46,11.91
  Bottom 0.508: v28.89,17.46 R4.1
+1V8  (via drill 0.35)
  Top 0.406: IC11.2 8.25,3.17 C11.2 8.23,2.85 v7.67,2.29
  Route2 0.305: v25.53,2.03 20.77,2.03 19.56,0.83 16.76,0.83 v14.8,2.79 14.8,3.75 v12.76,5.78 11.16,5.78 v7.67,2.29
  Bottom 0.2: R50.2 R48.2 | IC10.13 12.43,1.39 | IC10.22 9.01,3.63 8.97,3.59 | IC10.8 13.69,4.03 C8.2
  Bottom 0.305: C9.2 12.43,1.39 13.39,1.39 v14.8,2.79 | R48.2 7.12,2.83 v7.67,2.29 8.97,3.59 | T8.2 v25.53,2.03 T8.5 | v12.76,5.78 13.53,5.78 C8.2
  pour Top (no thermals): 6.6,3.68 8.51,3.68 9.02,3.17 9.02,2.6 8.89,2.48 8.26,2.48 7.87,2.1 6.73,2.1 6.6,2.22
+2V8  (via drill 0.3, 0.35)
  Top 0.508: IC5.2 C19.2 7.44,8.39 v7.46,8.41
  Route2 0.508: v30.96,13.81 30.96,18.1 v27.62,21.43
  Route2 0.61: v30.96,13.81 30,12.86 10.32,12.86 7.46,10 v7.46,8.41
  Bottom 0.508: v27.62,21.43 R2.1 | v30.96,13.81 30.93,13.79 R3.1
+3V3  (via drill 0.3, 0.35)
  Top 0.2: 42.54,20.58 C31.1
  Top 0.406: Q2.2 21.72,0.99 21.88,0.83 v22.32,0.83
  Top 0.508: IC4.13 3.6,19.32 3.97,19.68 v3.97,22.54
  Top 0.61: IC1.2 19.37,20.95 v19.14,20.73
  Bottom 0.2: R10.1 R9.1 35.38,22.23 34.16,22.23 R6.2 R15.2 31.93,22.25 v31.91,22.23
  Bottom 0.305: v22.32,0.83 22.3,0.85 R45.2 R44.2
  Bottom 0.406: J4.2 53.82,16.53 v53.82,16.83
  Bottom 0.508: C12.2 C13.2 v3.97,22.54 | R7.2 v15.24,25.72
  Bottom 0.61: J6.2 56.81,26.22 v56.83,26.19
  other vias: 43.66,20.48 43.66,19.84 43.66,19.05 43.66,18.41
  pour Route15 (rank 6): -3.17,30.8 -3.17,-5.4 59.69,-5.4 59.69,30.8 39.05,30.8 39.05,23.02 20,23.02 20,30.8
  pour Top (no thermals): 41.91,21.11 41.91,15.72 43.18,15.72 43.18,17.3 44.13,18.26 44.13,20.64 43.66,21.11
+5V  (via drill 0.35)
  Route2 0.61: v36.35,19.05 36.51,19.21 38.42,19.21 40.29,17.34 46.35,17.34 47.78,15.91 47.78,13.49 52.39,8.89 v53.5,8.89
  Bottom 0.508: IC7.1 35.81,17.03 C27.2
  Bottom 0.61: v36.35,19.05 36.35,17.37 35.81,16.82 IC7.1 | J5.2 53.84,8.55 v53.5,8.89
ANT  (via drill 0.35)
  Top 0.2: IC4.9 2.04,27.3 3.81,27.3 v3.97,27.15
  Bottom 0.2: v3.97,27.15 4,27.11 J2.FEED
AVDD_2V8
  Bottom 0.2: IC2.4 25.12,19.25 25.56,19.68 26.33,19.68 C1.2
  Bottom 0.508: R2.2 C1.2
BOLX
  pour Top (rank 2, no thermals): 42.23,15.4 42.23,15.24 43.66,15.24 44.45,16.03 48.58,16.03 48.74,16.19 48.74,17.62 48.58,17.78 44.13,17.78 43.66,17.3 43.66,15.72 43.34,15.4
BOOT  (via drill 0.35)
  Top 0.2: IC1.27 37.47,5.71 v36.83,6.35 37.16,6.68 v37.16,8.88
  Bottom 0.2: C14.2 36.09,6.35 v36.83,6.35 | v37.16,8.88 37.16,9.7 38.66,11.19 38.66,11.67 40.49,13.5 SW2.3 40.96,13.5 42.08,12.38 45.92,12.38 47.04,13.5 SW2.2
BULX
  pour Top (rank 2, no thermals): 42.23,14.61 43.66,14.61 44.45,13.81 48.58,13.81 48.74,13.65 48.74,12.22 48.58,12.06 43.97,12.06 43.66,12.38 43.66,14.13 43.34,14.45 42.23,14.45
BUTTON  (via drill 0.35)
  Top 0.2: IC1.24 v33.97,3.02
  Bottom 0.2: SW3.2 SW3.3 40.6,3.5 40.11,3.02 v33.97,3.02
CAM_HREF  (via drill 0.3)
  Top 0.2: IC1.7 20.95,14.61 v22.07,15.72
  Bottom 0.2: IC2.9 23.1,16.75 v22.07,15.72 | v22.07,15.72
CAM_PCLK  (via drill 0.3)
  Top 0.2: IC1.21 30.16,3.91 30.99,3.08 31.24,3.08 v31.37,2.95
  Bottom 0.2: v31.37,2.95 29.65,4.67 28.29,4.67 27.25,5.71 27.25,10.23 26.7,10.77 26.7,11.12 25.07,12.75 IC2.17
CAM_PWDN  (via drill 0.35)
  Top 0.152: IC1.16 23.81,4.65
  Top 0.2: 23.81,4.65 24.82,5.65 24.82,17.15 v25.61,17.94
  Bottom 0.2: IC2.8 24.92,17.25 v25.61,17.94 26.18,18.51 R14.2
CAM_RESET  (via drill 0.3)
  Top 0.2: v25.72,18.91 26.02,19.21 29.37,19.21 30,18.57 v30,17.94
  Bottom 0.2: v30,17.94 30.16,17.78 R20.1 | v25.72,18.91 25.56,18.91 24.9,18.25 IC2.6
CAM_SCL  (via drill 0.3)
  Top 0.2: v30.5,21.3 29.38,20.17 23.51,20.17 v22.7,19.37 22.07,18.73 22.07,18.26 20.95,17.14
  Top 0.305: IC1.5 20.95,17.14
  Bottom 0.2: R24.1 30.16,20.95 v30.5,21.3 | v22.7,19.37 23.32,18.75 IC2.5
CAM_SDA  (via drill 0.3)
  Top 0.2: IC1.4 20.8,18.41 | v31.47,21.47 31.07,21.87 30.11,21.87 28.82,20.57 22.95,20.57 v22.7,20.32 21.59,19.21 21.59,19.05 20.95,18.41
  Top 0.305: 20.8,18.41 20.95,18.41
  Bottom 0.2: R23.1 31.43,21.43 v31.47,21.47 | IC2.3 23.27,19.75 v22.7,20.32
CAM_VSYNC  (via drill 0.3)
  Top 0.2: IC1.6 20.95,15.88 22.7,17.62 v22.7,18.1
  Bottom 0.2: IC2.7 23.05,17.75 v22.7,18.1
CAM_XMCLK  (via drill 0.3)
  Top 0.2: IC1.8 21.57,13.34 v22.38,14.15
  Bottom 0.2: IC2.13 22.99,14.75 v22.38,14.15
CAM_Y2  (via drill 0.3)
  Top 0.2: v26.19,9.68 26.67,9.21 26.67,5.87 27.46,5.08 27.46,4.38 IC1.19
  Bottom 0.2: IC2.19 24.89,11.75 26,10.64 26,10.35 26.19,10.16 v26.19,9.68
CAM_Y3  (via drill 0.3)
  Top 0.2: v25.56,7.94 25.56,7.88 25.4,7.72 25.4,4.54 IC1.17
  Bottom 0.2: IC2.21 24.86,10.75 25.29,10.33 25.29,8.21 v25.56,7.94
CAM_Y4  (via drill 0.3)
  Top 0.2: v21.94,9.05 21.94,8.8 21.4,8.26 IC1.12
  Bottom 0.2: IC2.22 23.43,10.25 23.18,10 23.18,9.68 22.54,9.05 v21.94,9.05
CAM_Y5  (via drill 0.3)
  Top 0.2: IC1.18 26.35,5.18 26.19,5.34 26.19,8.57 v26.04,8.73
  Bottom 0.2: IC2.20 24.89,11.25 25.64,10.5 25.64,9.29 26.04,8.89 v26.04,8.73
CAM_Y6  (via drill 0.3)
  Top 0.2: IC1.20 28.89,3.84 30.23,2.51 v30.67,2.51
  Bottom 0.2: v30.67,2.51 29.94,2.51 26.84,5.61 26.84,10.06 26.35,10.55 26.35,10.81 24.91,12.25 IC2.18
CAM_Y7  (via drill 0.3)
  Top 0.2: v22.55,9.99 21.42,9.99 20.95,9.53 IC1.11
  Bottom 0.2: v22.55,9.99 23.03,10.47 23.03,13.03 23.25,13.25 IC2.16
CAM_Y8  (via drill 0.3)
  Top 0.2: IC1.10 20.63,10.9 v22.29,10.9
  Bottom 0.2: v22.29,10.9 22.61,11.22 22.61,13.41 23.45,14.25 IC2.14
CAM_Y9  (via drill 0.3)
  Top 0.2: IC1.9 19.84,12.06 18.95,12.95 v18.95,14.29
  Bottom 0.2: v18.95,14.29 19.43,14.77 22.07,14.77 22.55,15.25 IC2.12
CC1  (via drill 0.35)
  Top 0.2: J1.A5 50.62,14.62 50.16,15.08 50.16,17.51 v48.58,19.09
  Bottom 0.2: R30.2 48.94,18.73 v48.58,19.09
CC2  (via drill 0.35)
  Top 0.2: v48.58,20.34 51.3,17.62 J1.B5
  Bottom 0.2: R31.2 48.92,20 v48.58,20.34
DOVDD_2V8
  Bottom 0.2: R3.2 29.53,14.79 30.16,15.42 R20.2 30.64,16.01 31.43,16.8 R23.2 R24.2 | IC2.11 25.39,15.75 26.29,14.86
  Bottom 0.254: 26.29,14.86 C3.2
  Bottom 0.508: C3.2 C2.2 R3.2
DVDD_1V5
  Bottom 0.2: IC2.10 26.27,16.25 C5.2
  Bottom 0.508: C5.2 C4.2 R4.2
EN  (via drill 0.3, 0.35)
  Top 0.2: v21.96,21.04 21.96,20.72 20.92,19.68 IC1.3
  Route15 0.2: v21.96,21.04 25.93,21.04 26.65,20.32 v32.86,20.32 32.86,20.63 34.93,22.7 38.73,22.7 v39.37,23.34
  Bottom 0.2: SW1.3 SW1.2 40.47,26.5 39.37,25.4 v39.37,23.34 39.37,21.45 C15.2 | R15.1 v32.86,20.32
EN_5V  (via drill 0.3)
  Top 0.2: v34.92,13.18 33.81,12.06 33.81,7.14 32.7,6.03 IC1.23
  Bottom 0.2: R5.2 v34.92,13.18 35.81,14.06 IC7.3
ENABLE_3V3
  Top 0.2: IC9.D2 41.49,14.52 41.14,14.18 R1.1
GND  (via drill 0.3)
  Top 0.2: IC1.P$1 IC1.P$4
  Top 0.254: IC9.D4 41.67,15.32 41.43,15.56
  Top 0.406: IC11.1 8.51,1.27 8.6,1.18 v8.6,0.76
  Top 0.61: J1.S@4 57.31,20.64 57.78,21.11 | J1.S@4 57.31,19.05 | J1.S@4 57.27,20.16 56.04,20.16 | J1.S@4 57.34,20.16 58.74,20.16 | J1.S@1 53.13,21.38 | J1.S@1 54.73,20.2 54.77,20.16 | J1.S@1 51.31,20.2 | J1.S@5 53.13,10.42 | J1.S@5 53.16,11.59 54.77,11.59 | J1.S@5 51.56,11.55 | J1.S@7 55.91,11.55 | J1.S@7 57.31,12.54 | J1.S@7 58.61,11.55
  Top 0.813: 25.88,15.93 IC1.P$7 26.63,16.67 | IC1.P$8 28.03,16.67 | 29.43,16.67 IC1.P$9 30.16,15.93 | IC1.P$2 30.16,14.53 | 30.16,13.12 IC1.P$3 29.43,12.38 | IC1.P$4 28.03,12.38 | 26.63,12.38 IC1.P$5 25.88,13.12 | IC1.P$6 25.88,14.53
  Bottom 0.2: IC2.15 25.18,13.75 v25.4,13.97
  Bottom 0.254: D2.1 32.45,11.7 C28.1
  Bottom 0.61: J1.S@5 53.13,10.53 | J1.S@5 51.63,11.55 | J1.S@5 53.16,11.59 54.77,11.59 | 56.04,11.59 56.07,11.55 J1.S@7 57.31,12.86 | 57.31,19.05 J1.S@4 57.34,20.16 58.74,20.16 | 53.18,21.27 53.13,21.22 J1.S@1 51.63,20.2
  other vias: 48.74,23.81 44.45,14.92 44.93,15.4 44.93,14.45 45.88,15.4 45.4,14.92 45.88,14.45 28.73,7.3 34.31,5.98 33.08,2.95 33.66,19.37 28.42,18.16 44.77,19.68 42.86,23.97 45.4,18.89 30.96,10.16 29.21,18.57 40.96,15.88 31.11,1.68 41.43,4.92 43.81,8.1 28.42,11.27 28.26,9.53 50.8,17.14 55.88,18.57 53.98,10 9.11,6.13 9.68,11.11 8.41,8.73 9.62,1.59 17.05,2.54 29.31,1.49 16.83,8.41 16.83,10.32 12.1,3.81
  pour Bottom (rank 6): -3.49,31.11 -3.49,-5.71 59.69,-5.71 59.69,31.11
  pour Route2 (rank 6): -2.86,30.48 -2.86,-5.08 59.69,-5.08 59.69,30.48 39.05,30.48 39.05,23.02 20,23.02 20,30.48
  pour Top (isolate 0.05, rank 6): -2.54,30.16 -2.54,-4.76 59.69,-4.76 59.69,30.16
  pour Top (rank 5): 42.23,15.08 42.23,14.76 43.81,14.76 44.61,13.97 48.58,13.97 48.74,14.13 48.74,15.72 48.58,15.88 44.61,15.88 43.81,15.08
  pour Top (no thermals): 25.08,17.46 30.96,17.46 30.96,11.75 25.08,11.75
  pour Top (no thermals): 8.26,8.41 8.26,5.68 10,5.68 10,8.41
IO14
  Top 0.2: R16.2 33.75,1.43 31.43,3.75 IC1.22
IO19  (via drill 0.3)
  Top 0.2: v23.81,6.99 IC1.13
  Route2 0.2: v28.73,8.73 26.99,6.99 v23.81,6.99
  Bottom 0.2: R33.1 v28.73,8.73
IO20  (via drill 0.3)
  Top 0.2: v23.81,6.03 20.84,6.03 IC1.14
  Route2 0.2: v28.57,5.87 28.42,6.03 v23.81,6.03
  Bottom 0.2: R34.1 29.21,5.87 29.2,5.86 29.19,5.87 v28.57,5.87
IO48
  Top 0.2: IC1.25 35.26,2.82 R8.2
LED_DIN
  Bottom 0.2: R39.2 8.23,24.61 7.94,24.61 7.17,23.84 D1.3
LED_LV  (via drill 0.3, 0.35)
  Top 0.2: IC1.26 36.53,5.07 v36.51,5.08
  Route2 0.2: v27.42,11.11 26.94,11.59 10.79,11.59 v10.64,11.43
  Route15 0.2: v10.64,11.43 9.37,12.7 v9.37,23.65
  Bottom 0.2: v27.42,11.11 27.62,10.91 27.62,5.86 28.4,5.08 v36.51,5.08 36.51,4.15 R13.2 | R39.1 9.23,23.79 v9.37,23.65
LORA_!CS  (via drill 0.3, 0.35)
  Top 0.2: v37.31,18.41 IC1.37 | IC4.5 15.19,21.32 v15.08,21.43
  Route15 0.2: v37.31,18.41 36.51,17.62 34.72,17.62 33.8,16.7 20.29,16.7 15.56,21.43 v15.08,21.43
LORA_INT  (via drill 0.3, 0.35)
  Top 0.2: v37.31,17.14 IC1.36
  Route15 0.2: v37.31,17.14 34.8,17.14 34.01,16.35 19.84,16.35 15.56,20.64 v13.34,20.64
  Bottom 0.2: D5.C D6.C 12.69,23.95 R17.2 12.86,21.11 v13.34,20.64
LORA_RESET  (via drill 0.35)
  Top 0.2: v18.73,23.97 18.08,23.32 IC4.6
  Bottom 0.2: C29.2 R7.1 15.26,23.97 v18.73,23.97
MISO  (via drill 0.3, 0.35)
  Top 0.2: R27.1 12.54,9.84 12.97,9.42 v14.92,9.42 15.08,9.26 SD1.MISO | IC1.33 37.94,13.34 36.99,12.38 v35.08,12.38 | v15.08,15.24 15.16,15.32 IC4.2
  Route15 0.2: v35.08,12.38 34.61,11.91 34.61,10.27 29.38,5.04 18.34,5.04 14.92,8.46 v14.92,9.42 14.92,15.08 v15.08,15.24
MOSI  (via drill 0.3, 0.35)
  Top 0.2: IC1.31 v35.72,10.79 | R26.1 11.62,5.56 11.62,6.16 12.26,6.79 14.1,6.79 15.37,5.53 16.38,5.53 v17.14,4.76 17.24,4.86 SD1.MOSI | v13.65,16.83 14.14,17.32 IC4.3
  Route15 0.2: v35.72,10.79 35.72,10.39 29.67,4.34 17.57,4.34 v17.14,4.76 17.14,5.14 16.07,6.22 15.46,6.22 13.65,8.03 v13.65,16.83
N$1  (via drill 0.35)
  Top 0.2: IC4.14 3.79,17.32 v3.81,17.3
  Bottom 0.2: v3.81,17.3 6.35,17.3 10.32,21.27 D5.A
N$2  (via drill 0.35)
  Top 0.2: IC4.15 3.73,15.32 v3.81,15.4
  Bottom 0.2: v3.81,15.4 6.35,15.4 11.59,20.64 D6.A
N$3
  Bottom 0.406: J2.1 3.1,28.1 5.08,28.1 4.99,28.01 J2.2 5.38,27.17 5.87,26.67 R37.2
N$4  (via drill 0.35)
  Top 0.2: R16.1 36.76,1.21 v37.47,1.21
  Route15 0.2: v37.47,1.21 37.97,1.71 55.55,1.71 56.87,3.03 56.87,4.91 55.12,6.66 55.12,22.58 v56.83,24.29
  Bottom 0.2: v56.83,24.29 56.71,24.17 55.23,24.17 J6.4
N$5
  Bottom 0.406: IC7.6 32.2,16.19 C26.2
N$6
  Bottom 0.406: IC7.4 32.2,14.29 C26.1
N$8  (via drill 0.35)
  Top 0.2: R12.2 44.93,8.04 v45.27,8.39
  Bottom 0.2: v45.27,8.39 46.27,8.39 D4.C
N$9
  Top 0.2: IC3.1 45.58,5.36 R12.1
N$10
  Top 0.2: IC3.5 46.04,8.71 R11.2
N$13  (via drill 0.35)
  Top 0.2: R8.1 36.99,2.54 v37.47,2.06
  Route15 0.2: v37.47,2.06 55.4,2.06 56.52,3.17 56.52,4.76 54.77,6.51 54.77,23.18 v56.83,25.24
  Bottom 0.2: v56.83,25.24 56.81,25.22 J6.3
REGOUT1
  Bottom 0.2: IC10.10 13.97,3.23 C10.2
SCK  (via drill 0.3, 0.35)
  Top 0.2: IC1.32 37.47,12.06 36.99,11.59 v35.4,11.59 | R28.1 13.97,8.57 15.61,6.93 v15.63,6.93 15.76,7.06 SD1.SCK | IC4.4 15.13,19.32 v15.08,19.37
  Route15 0.2: v35.4,11.59 34.99,11.18 34.99,10.16 29.52,4.69 18.16,4.69 15.92,6.93 v15.63,6.93 15.63,6.95 14.29,8.3 14.29,18.57 v15.08,19.37
SCL  (via drill 0.3, 0.35)
  Top 0.2: v36.67,20.32 37.29,20.94 IC1.39 | IC8.7 49.76,13.66 v49.9,13.81
  Route2 0.2: v36.67,20.32 36.67,20.64 37.91,21.87 44.01,21.87 48.9,16.99 48.9,14.82 v49.9,13.81
  Route15 0.2: v49.9,13.81 50.13,14.04 v53.58,14.04 | v36.67,20.32 37.86,19.13 37.86,14.18 37.47,13.79 37.47,10.64 30.04,3.22 27.73,3.22 v27.37,2.86
  Bottom 0.2: R10.2 v36.67,20.32 | J4.4 54.43,14.53 53.94,14.04 v53.58,14.04 | R44.1 24.61,2.79 T8.6 24.63,3.16 24.99,3.52 26.7,3.52 v27.37,2.86
SD_!CS  (via drill 0.3, 0.35)
  Top 0.2: IC1.34 38.1,14.61 36.51,13.02 v35.88,13.02 | SD1.CS 16.93,3.76 v16.54,4.15 15.52,5.17 15.22,5.17 13.95,6.44 12.4,6.44 11.97,6.01 11.97,5.41 11.49,4.93 11.49,4.29 R29.1
  Route15 0.2: v35.88,13.02 36.27,12.62 36.27,10.45 29.76,3.93 16.76,3.93 v16.54,4.15
SD_ENABLE
  Top 0.2: Q2.1 20.83,4.22 IC1.15
SD_SW  (via drill 0.3, 0.35)
  Top 0.2: v36.99,14.45 36.99,15.56 37.31,15.88 | IC1.35 37.31,15.88 | 37.31,15.88 34.45,18.73 34.45,20.01 v34.14,20.32 v34.13,20.32 | v16.1,2.54 15.17,1.61 SD1.SW1
  Route15 0.2: v36.99,14.45 36.99,10.66 29.9,3.57 17.1,3.57 16.1,2.57 v16.1,2.54
  Bottom 0.2: v34.13,20.32 R6.1
SDA  (via drill 0.3, 0.35)
  Top 0.2: v35.4,20.32 36.04,19.68 IC1.38 | IC8.8 49.26,15.28 v49.53,15.56
  Route2 0.2: v35.4,20.32 37.31,22.23 44.16,22.23 49.53,16.85 v49.53,15.56
  Route15 0.2: v53.83,14.91 53.49,14.91 52.97,14.39 50.46,14.39 50.14,14.39 49.53,15 v49.53,15.56 | v35.4,20.32 35.96,20.88 36.9,20.88 37.34,20.44 37.34,20.15 38.21,19.28 38.21,14.04 37.82,13.64 37.82,10.49 30.19,2.87 28.23,2.87 v27.37,2
  Bottom 0.2: R9.2 v35.4,20.32 | J4.3 54.14,15.53 53.83,15.23 v53.83,14.91 | R45.1 23.3,1.02 23.81,0.51 26.1,0.51 26.43,0.84 T8.3 26.65,1.28 v27.37,2
SDIO_3V3  (via drill 0.35)
  Top 0.254: C7.2 10.77,7.36 10.77,7.43 9.82,8.38 R28.2 R27.2 | C6.2 10.82,5.87 10.77,5.82 10.77,5.9 9.82,4.95 R26.2 R29.2
  Top 0.305: SD1.VCC 15.63,5.96 14.29,7.3 v11.75,7.3
  Top 0.406: C7.2 v11.75,7.3 10.95,7.3 10.82,7.17 C6.2 | Q2.3 20.03,1.94 19.49,2.48 v19.49,2.98
  Route2 0.406: v11.75,7.3 13.91,7.3 14.99,6.22 14.99,4.7 16.29,3.4 19.08,3.4 v19.49,2.98
USB-DN  (via drill 0.35)
  Top 0.2: J1.A7 53.05,16.12 53.34,15.84 53.34,15.24 53.23,15.12 J1.B7 51.01,15.12 v50.8,15.34
  Bottom 0.2: R33.2 30.5,7.75 D3.1 32.47,7.7 32.86,8.1 37.62,8.1 39.53,10 48.74,10 50.48,11.75 50.48,15.02 v50.8,15.34
USB-DP  (via drill 0.35)
  Top 0.2: J1.B6 51.71,16.62 v51.28,16.19 51.84,15.62 J1.A6
  Bottom 0.2: R34.2 30.5,6.85 D3.2 32.3,6.9 33.02,7.62 37.78,7.62 39.69,9.53 49.05,9.53 50.96,11.43 50.96,14.61 51.44,15.08 51.44,16.03 v51.28,16.19
V_LED  (via drill 0.35)
  Top 0.2: v40.14,15.31 R1.2
  Route2 0.406: v53.5,4.13 51.09,6.54 51.09,9.05 46.99,13.14 46.99,15.56 45.97,16.58 40.14,16.58 v40.14,15.31 40.14,16.35 33.66,16.35 27.62,22.38 5.24,22.38 v5.08,22.54
  Bottom 0.406: C18.2 5.18,23.37 D1.4
  Bottom 0.508: C18.2 v5.08,22.54
  Bottom 0.61: SW4.2 52.75,4.88 v53.5,4.13
VBAT  (via drill 0.35)
  Top 0.2: J3.1 52.55,5.4 49.69,5.4 49.76,5.46 IC8.2 IC8.3
  Route2 0.61: v48.42,4.6 46.67,6.35 42.55,6.35 41.13,7.76 31.45,7.76 29.37,9.84 v29.21,9.84
  Bottom 0.305: D2.6 29.46,10.7 C17.2
  Bottom 0.61: v29.21,9.84 C17.2
  pour Top (no thermals): 47.62,5.87 47.62,3.49 48.9,3.49 50.16,4.76 54.61,4.76 54.77,4.92 54.77,6.03 54.61,6.19 47.94,6.19
VIN  (via drill 0.35)
  Top 0.508: C21.2 7.12,10.16 IC6.3 3.65,9.83 v3.65,8.41 3.65,7 IC5.3 | IC5.3 7.12,6.67 C22.2 | C24.2 3.98,5.36 IC5.3
  Route2 0.61: v3.65,8.41 5.08,6.99 8.89,6.99 10.48,8.57 13.34,8.57 13.49,8.41 15.56,8.41 19.68,4.29 35.08,4.29 35.4,3.97 38.1,3.97 41.12,0.95 v53.98,0.95
  Bottom 0.61: v53.98,0.95 52.9,0.95 SW4.5
  pour Top (no thermals): 4.92,11.91 -0.32,11.91 -0.32,-0.16 4.92,-0.16
VSWITCHED  (via drill 0.35)
  Top 0.2: v40.96,14.92 IC9.D3
  Route2 0.61: v50.32,3.65 50.32,8.73 47.94,11.11 v42.7,11.11 | v34.61,15.4 34.77,15.56 38.58,15.56 39.66,14.48 40.51,14.48 v40.96,14.92 42.55,13.34 v42.7,13.34
  Route15 0.61: v30.96,11.21 30.96,11.75 v34.61,15.4
  Bottom 0.254: 30.85,11.2 30.96,11.31 31.06,11.2
  Bottom 0.305: D2.7 30.85,11.2 | D2.2 31.06,11.2
  Bottom 0.406: v30.96,11.21 30.96,11.31
  Bottom 0.508: IC7.5 34.52,15.24 34.61,15.33 v34.61,15.4 34.61,16.45 33.97,17.08 C25.2
  Bottom 0.61: SW4.3 51.25,5.05 50.32,4.13 v50.32,3.65 50.32,3.17 51.25,2.25 SW4.6
  pour Top (no thermals): 41.91,14.13 43.18,14.13 43.18,9.53 42.23,9.53 42.23,12.86 41.91,13.18
VUSB  (via drill 0.35)
  Top 0.406: J1.VBUS2 51.57,13.43 v51.54,13.46 | v51.55,18.41 51.64,18.32 J1.VBUS
  Route2 0.61: v48.9,8.1 47.47,9.53 40.64,9.53 40.16,10 32.86,10 v32.7,9.84 | v51.54,13.46 51.54,13.78 52.55,14.78 52.55,17.46 51.59,18.41 v51.55,18.41
  Route15 0.61: v51.54,13.46 48.9,10.81 v48.9,8.1
  Bottom 0.305: D2.3 32.45,10.7 C28.2
  Bottom 0.61: C28.2 v32.7,9.84 | v48.9,8.1 48.32,8.1 D4.A
  pour Top (no thermals): 47.31,9.37 47.31,7.62 47.62,7.3 49.37,7.3 49.37,8.1 48.1,9.37

### Text on the board
tPlace: USB / charge / & prog. | open / Hardware | senseBox / Eye | - | + | V1.3 | Battery
bPlace: Lora Ant. | Rst | GPIO | LED | Qwiic | lächeln | Boot | 5V / Out | Sw | on | off